# EAGLE schematic PCB(beta) (EAGLE 8.1.0), part 1 of 2

## Sheet 1 of 20: Joule Connectors
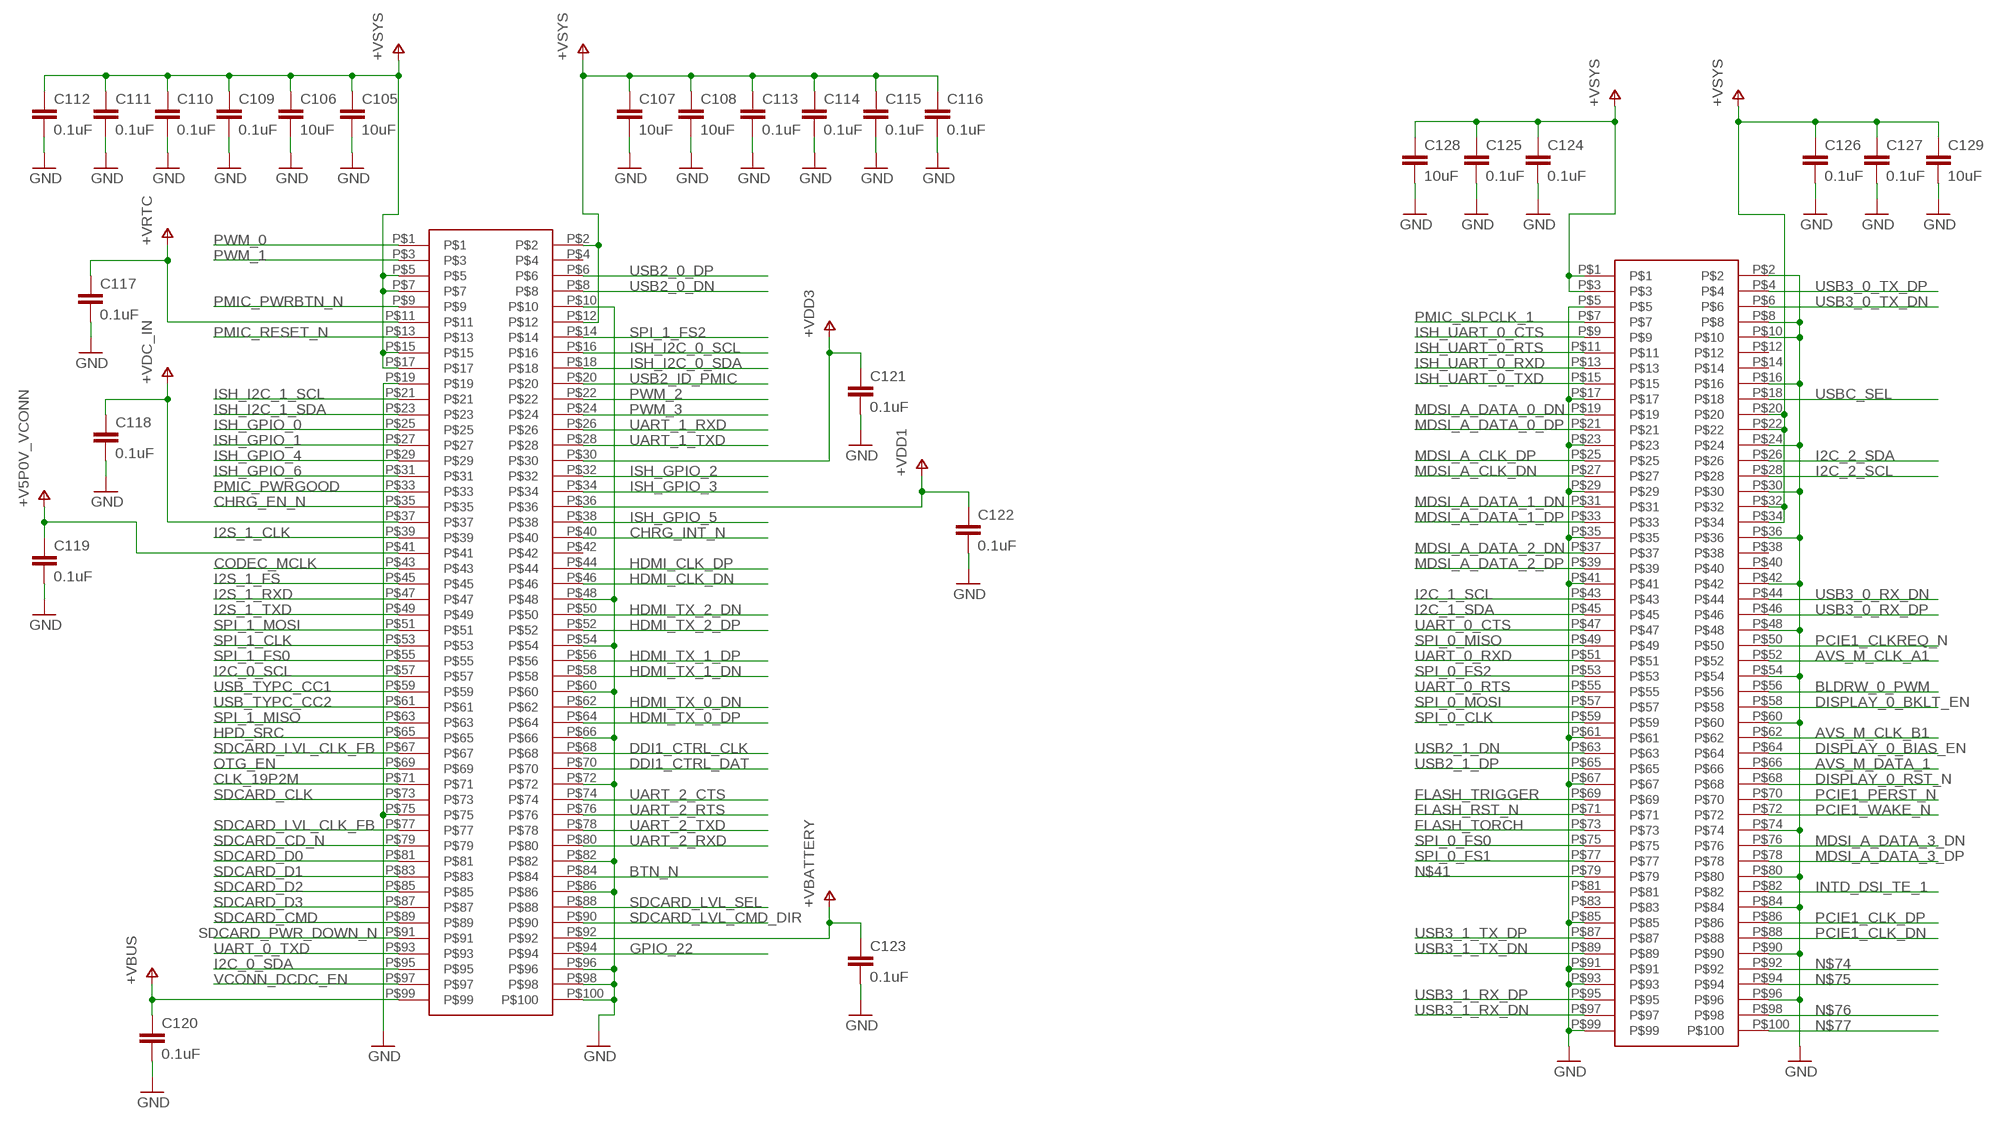
[diagram p0: schematic, sheet 1]

### Parts
C105  10uF  10UF-0603-6.3V-20%  [0603]
C106  10uF  10UF-0603-6.3V-20%  [0603]
C107  10uF  10UF-0603-6.3V-20%  [0603]
C108  10uF  10UF-0603-6.3V-20%  [0603]
C109  0.1uF  0.1UF-0603-25V-(+80/-20%)  [0603]
C110  0.1uF  0.1UF-0603-25V-(+80/-20%)  [0603]
C111  0.1uF  0.1UF-0603-25V-(+80/-20%)  [0603]
C112  0.1uF  0.1UF-0603-25V-(+80/-20%)  [0603]
C113  0.1uF  0.1UF-0603-25V-(+80/-20%)  [0603]
C114  0.1uF  0.1UF-0603-25V-(+80/-20%)  [0603]
C115  0.1uF  0.1UF-0603-25V-(+80/-20%)  [0603]
C116  0.1uF  0.1UF-0603-25V-(+80/-20%)  [0603]
C117  0.1uF  0.1UF-0603-25V-(+80/-20%)  [0603]
C118  0.1uF  0.1UF-0603-25V-(+80/-20%)  [0603]
C119  0.1uF  0.1UF-0603-25V-(+80/-20%)  [0603]
C120  0.1uF  0.1UF-0603-25V-(+80/-20%)  [0603]
C121  0.1uF  0.1UF-0603-25V-(+80/-20%)  [0603]
C122  0.1uF  0.1UF-0603-25V-(+80/-20%)  [0603]
C123  0.1uF  0.1UF-0603-25V-(+80/-20%)  [0603]
C124  0.1uF  0.1UF-0603-25V-(+80/-20%)  [0603]
C125  0.1uF  0.1UF-0603-25V-(+80/-20%)  [0603]
C126  0.1uF  0.1UF-0603-25V-(+80/-20%)  [0603]
C127  0.1uF  0.1UF-0603-25V-(+80/-20%)  [0603]
C128  10uF  10UF-0603-6.3V-20%  [0603]
C129  10uF  10UF-0603-6.3V-20%  [0603]
U$55  DF40C-100DS-0.4V(51)_100PINCONNECTOR  [100-DF40]
U$56  DF40C-100DS-0.4V(51)_100PINCONNECTOR  [100-DF40]

### Nets
+V5P0V_VCONN: C119.1 U$55.P$41
+VBATTERY: C123.1 U$55.P$92 ; also sheet 3
+VBUS: C120.1 U$55.P$99 ; also sheet 2,4,7
+VDC_IN: C118.1 U$55.P$37 ; also sheet 2
+VDD1: C122.1 U$55.P$36 ; also sheet 6,14,16,17
+VDD3: C121.1 U$55.P$30 ; also sheet 4,5,14
+VRTC: C117.1 U$55.P$11 ; also sheet 17
+VSYS: C105.1 C106.1 C107.1 C108.1 C109.1 C110.1 C111.1 C112.1 C113.1 C114.1 C115.1 C116.1 U$55.P$2 U$55.P$5 U$55.P$7 U$55.P$12 U$55.P$15 U$55.P$17 ; also sheet 3,4,5,6
AVS_M_CLK_A1: U$56.P$52 ; also sheet 15
AVS_M_CLK_B1: U$56.P$62 ; also sheet 15
AVS_M_DATA_1: U$56.P$66 ; also sheet 15
BLDRW_0_PWM: U$56.P$56 ; also sheet 15
BTN_N: U$55.P$84 ; also sheet 16
CHRG_EN_N: U$55.P$35 ; also sheet 3
CHRG_INT_N: U$55.P$40 ; also sheet 3
CLK_19P2M: U$55.P$71 ; also sheet 13
CODEC_MCLK: U$55.P$43 ; also sheet 13
DDI1_CTRL_CLK: U$55.P$68 ; also sheet 11
DDI1_CTRL_DAT: U$55.P$70 ; also sheet 11
DISPLAY_0_BIAS_EN: U$56.P$64 ; also sheet 15
DISPLAY_0_BKLT_EN: U$56.P$58 ; also sheet 15
DISPLAY_0_RST_N: U$56.P$68 ; also sheet 15
FLASH_RST_N: U$56.P$71 ; also sheet 15
FLASH_TORCH: U$56.P$73 ; also sheet 15
FLASH_TRIGGER: U$56.P$69 ; also sheet 15
GND: C105.2 C106.2 C107.2 C108.2 C109.2 C110.2 C111.2 C112.2 C113.2 C114.2 C115.2 C116.2 C117.2 C118.2 C119.2 C120.2 C121.2 C122.2 C123.2 C124.2 C125.2 C126.2 C127.2 C128.2 C129.2 U$55.P$10 U$55.P$19 U$55.P$48 U$55.P$54 U$55.P$60 U$55.P$66 U$55.P$72 U$55.P$75 U$55.P$82 U$55.P$86 U$55.P$96 U$55.P$98 U$55.P$100 U$56.P$2 U$56.P$5 U$56.P$8 U$56.P$10 U$56.P$16 U$56.P$17 U$56.P$23 U$56.P$24 U$56.P$29 U$56.P$30 U$56.P$35 U$56.P$36 U$56.P$41 U$56.P$42 U$56.P$48 U$56.P$54 U$56.P$60 U$56.P$61 U$56.P$67 U$56.P$74 U$56.P$80 U$56.P$84 U$56.P$85 U$56.P$90 U$56.P$91 U$56.P$93 U$56.P$96 U$56.P$99 ; also sheet 2,3,4,5,6,7,9,10,11,12,13,14,15,16,17,18,19,20
GPIO_22: U$55.P$94 ; also sheet 13
HDMI_CLK_DN: U$55.P$46 ; also sheet 11
HDMI_CLK_DP: U$55.P$44 ; also sheet 11
HDMI_TX_0_DN: U$55.P$62 ; also sheet 11
HDMI_TX_0_DP: U$55.P$64 ; also sheet 11
HDMI_TX_1_DN: U$55.P$58 ; also sheet 11
HDMI_TX_1_DP: U$55.P$56 ; also sheet 11
HDMI_TX_2_DN: U$55.P$50 ; also sheet 11
HDMI_TX_2_DP: U$55.P$52 ; also sheet 11
HPD_SRC: U$55.P$65 ; also sheet 11
I2C_0_SCL: U$55.P$57 ; also sheet 3,13,17
I2C_0_SDA: U$55.P$95 ; also sheet 3,13,17
I2C_1_SCL: U$56.P$43 ; also sheet 15
I2C_1_SDA: U$56.P$45 ; also sheet 15
I2C_2_SCL: U$56.P$28 ; also sheet 15
I2C_2_SDA: U$56.P$26 ; also sheet 15
I2S_1_CLK: U$55.P$39 ; also sheet 13
I2S_1_FS: U$55.P$45 ; also sheet 13
I2S_1_RXD: U$55.P$47 ; also sheet 13
I2S_1_TXD: U$55.P$49 ; also sheet 13
INTD_DSI_TE_1: U$56.P$82
ISH_GPIO_0: U$55.P$25 ; also sheet 13,14
ISH_GPIO_1: U$55.P$27 ; also sheet 13,14
ISH_GPIO_2: U$55.P$32 ; also sheet 13,14
ISH_GPIO_3: U$55.P$34 ; also sheet 13,14
ISH_GPIO_4: U$55.P$29 ; also sheet 13
ISH_GPIO_5: U$55.P$38 ; also sheet 13
ISH_GPIO_6: U$55.P$31 ; also sheet 13
ISH_I2C_0_SCL: U$55.P$16 ; also sheet 13
ISH_I2C_0_SDA: U$55.P$18 ; also sheet 13
ISH_I2C_1_SCL: U$55.P$21 ; also sheet 13
ISH_I2C_1_SDA: U$55.P$23 ; also sheet 13
ISH_UART_0_CTS: U$56.P$9 ; also sheet 15
ISH_UART_0_RTS: U$56.P$11 ; also sheet 15
ISH_UART_0_RXD: U$56.P$13 ; also sheet 15
ISH_UART_0_TXD: U$56.P$15 ; also sheet 15
MDSI_A_CLK_DN: U$56.P$27
MDSI_A_CLK_DP: U$56.P$25
MDSI_A_DATA_0_DN: U$56.P$19
MDSI_A_DATA_0_DP: U$56.P$21
MDSI_A_DATA_1_DN: U$56.P$31
MDSI_A_DATA_1_DP: U$56.P$33
MDSI_A_DATA_2_DN: U$56.P$37
MDSI_A_DATA_2_DP: U$56.P$39
MDSI_A_DATA_3_DN: U$56.P$76
MDSI_A_DATA_3_DP: U$56.P$78
N$41: U$56.P$79
N$74: U$56.P$92
N$75: U$56.P$94
N$76: U$56.P$98
N$77: U$56.P$100
OTG_EN: U$55.P$69 ; also sheet 4
PCIE1_CLK_DN: U$56.P$88
PCIE1_CLK_DP: U$56.P$86
PCIE1_CLKREQ_N: U$56.P$50
PCIE1_PERST_N: U$56.P$70
PCIE1_WAKE_N: U$56.P$72
PMIC_PWRBTN_N: U$55.P$9 ; also sheet 3,16
PMIC_PWRGOOD: U$55.P$33 ; also sheet 13
PMIC_RESET_N: U$55.P$13 ; also sheet 13
PMIC_SLPCLK_1: U$56.P$7 ; also sheet 15
PWM_0: U$55.P$1 ; also sheet 13
PWM_1: U$55.P$3 ; also sheet 13
PWM_2: U$55.P$22 ; also sheet 13
PWM_3: U$55.P$24 ; also sheet 13
SDCARD_CD_N: U$55.P$79 ; also sheet 10
SDCARD_CLK: U$55.P$73 ; also sheet 10
SDCARD_CMD: U$55.P$89 ; also sheet 10
SDCARD_D0: U$55.P$81 ; also sheet 10
SDCARD_D1: U$55.P$83 ; also sheet 10
SDCARD_D2: U$55.P$85 ; also sheet 10
SDCARD_D3: U$55.P$87 ; also sheet 10
SDCARD_LVL_CLK_FB: U$55.P$67 U$55.P$77 ; also sheet 10
SDCARD_LVL_CMD_DIR: U$55.P$90 ; also sheet 10
SDCARD_LVL_SEL: U$55.P$88 ; also sheet 10
SDCARD_PWR_DOWN_N: U$55.P$91 ; also sheet 10
SPI_0_CLK: U$56.P$59 ; also sheet 15
SPI_0_FS0: U$56.P$75 ; also sheet 15
SPI_0_FS1: U$56.P$77 ; also sheet 15
SPI_0_FS2: U$56.P$53 ; also sheet 15
SPI_0_MISO: U$56.P$49 ; also sheet 15
SPI_0_MOSI: U$56.P$57 ; also sheet 15
SPI_1_CLK: U$55.P$53 ; also sheet 13
SPI_1_FS0: U$55.P$55 ; also sheet 13
SPI_1_FS2: U$55.P$14 ; also sheet 13,16
SPI_1_MISO: U$55.P$63 ; also sheet 13
SPI_1_MOSI: U$55.P$51 ; also sheet 13
UART_0_CTS: U$56.P$47 ; also sheet 15
UART_0_RTS: U$56.P$55 ; also sheet 15
UART_0_RXD: U$56.P$51 ; also sheet 15
UART_0_TXD: U$55.P$93 ; also sheet 13
UART_1_RXD: U$55.P$26 ; also sheet 13
UART_1_TXD: U$55.P$28 ; also sheet 13,16
UART_2_CTS: U$55.P$74 ; also sheet 9
UART_2_RTS: U$55.P$76 ; also sheet 9
UART_2_RXD: U$55.P$80 ; also sheet 9
UART_2_TXD: U$55.P$78 ; also sheet 9,16
USB2_0_DN: U$55.P$8 ; also sheet 7
USB2_0_DP: U$55.P$6 ; also sheet 7
USB2_1_DN: U$56.P$63 ; also sheet 8
USB2_1_DP: U$56.P$65 ; also sheet 8
USB2_ID_PMIC: U$55.P$20
USB3_0_RX_DN: U$56.P$44 ; also sheet 7
USB3_0_RX_DP: U$56.P$46 ; also sheet 7
USB3_0_TX_DN: U$56.P$6 ; also sheet 7
USB3_0_TX_DP: U$56.P$4 ; also sheet 7
USB3_1_RX_DN: U$56.P$97 ; also sheet 8
USB3_1_RX_DP: U$56.P$95 ; also sheet 8
USB3_1_TX_DN: U$56.P$89 ; also sheet 8
USB3_1_TX_DP: U$56.P$87 ; also sheet 8
USB_TYPC_CC1: U$55.P$59 ; also sheet 7
USB_TYPC_CC2: U$55.P$61 ; also sheet 7
USBC_SEL: U$56.P$18 ; also sheet 7
V+: C124.1 C125.1 C126.1 C127.1 C128.1 C129.1 U$56.P$1 U$56.P$3 U$56.P$20 U$56.P$22 U$56.P$32 U$56.P$34 ; supply symbol labelled +VSYS ; also sheet 3
VCONN_DCDC_EN: U$55.P$97 ; also sheet 4
Unconnected: U$55.P$4 U$55.P$42 U$56.P$12 U$56.P$14 U$56.P$38 U$56.P$40 U$56.P$81 U$56.P$83

## Sheet 2 of 20: Input Power Distribution
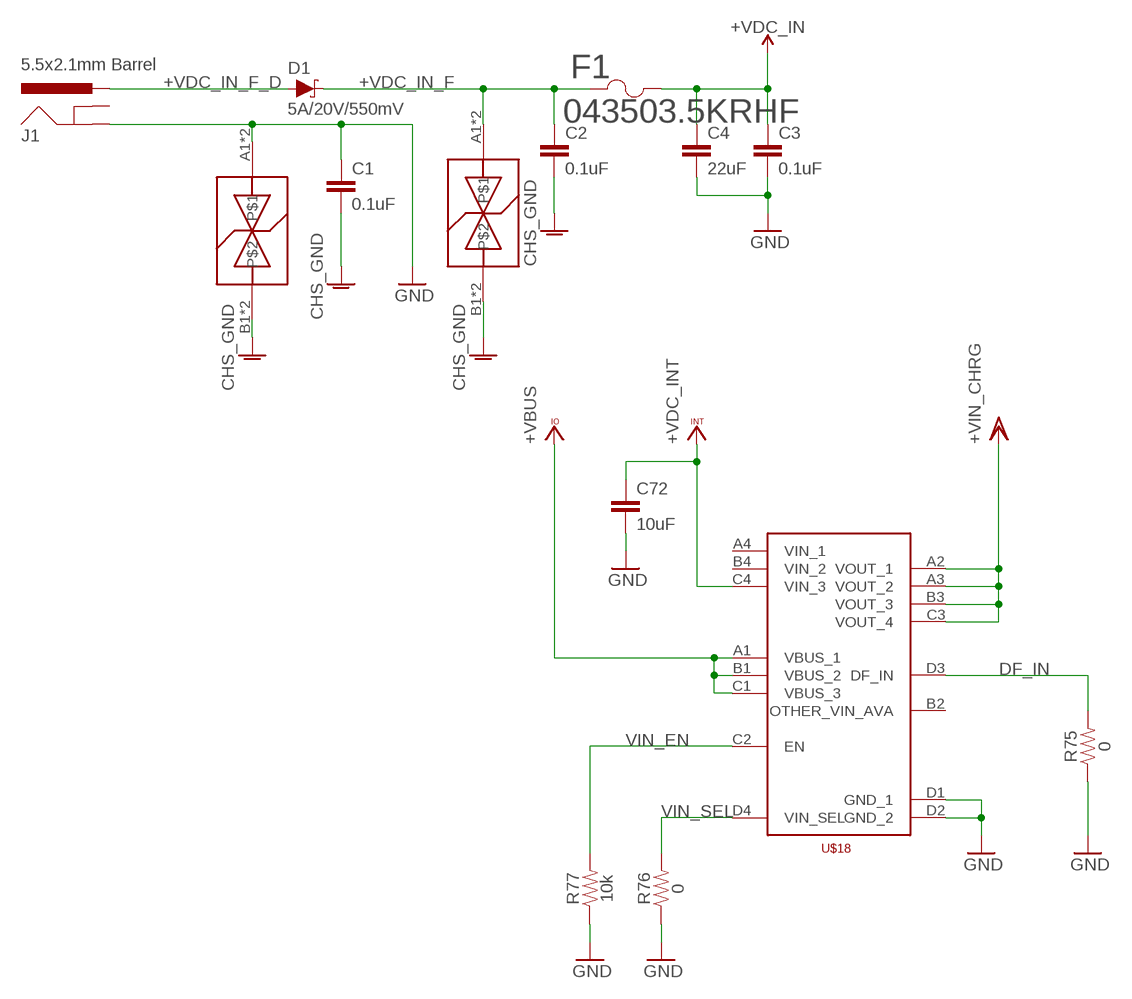
[diagram p1: schematic, sheet 2]

### Parts
C1  0.1uF  0.1UF-0603-25V-(+80/-20%)  [0603]
C2  0.1uF  0.1UF-0603-25V-(+80/-20%)  [0603]
C3  0.1uF  0.1UF-0603-25V-(+80/-20%)  [0603]
C4  22uF  22UF-0805-6.3V-20%  [0805]
C72  10uF  10UF-0603-6.3V-20%  [0603]
D1  5A/20V/550mV  DIODE-SCHOTTKY-B340A  [SMA-DIODE]
F1  043503.5KRHF  [0435SERIES]
J1  5.5x2.1mm Barrel  POWER_JACKSMD  [POWER_JACK_SMD]
R75  0  0OHM-0603-1/10W-5%  [0603]
R76  0  0OHM-0603-1/10W-5%  [0603]
R77  10k  10KOHM-0603-1/10W-1%  [0603]
U$2  LFTVS18-1F3_FLIPCHIP  [4-UFBGA]
U$3  LFTVS18-1F3_FLIPCHIP  [4-UFBGA]
U$18  FPF3042UCX  [16-WLCSP]

### Nets
+VBUS: U$18.A1(VBUS_1) U$18.B1(VBUS_2) U$18.C1(VBUS_3) ; also sheet 1,4,7
+VDC_IN: C3.1 C4.1 C72.1 F1.2 U$18.C4(VIN_3) ; supply symbol labelled +VDC_INT ; also sheet 1
+VDC_IN_F: C2.1 D1.C F1.1 U$2.A1 U$2.A2
+VDC_IN_F_D: D1.A J1.VIN0(PWR)
+VIN_CHRG: U$18.A2(VOUT_1) U$18.A3(VOUT_2) U$18.B3(VOUT_3) U$18.C3(VOUT_4) ; also sheet 3
CHS_GND: C1.2 C2.2 U$2.B1 U$2.B2 U$3.B1 U$3.B2 ; also sheet 7,8,9,10,12,17
DF_IN: R75.2 U$18.D3(DF_IN)
GND: C1.1 C3.2 C4.2 C72.2 J1.P$4(GND) R75.1 R76.1 R77.1 U$3.A1 U$3.A2 U$18.D1(GND_1) U$18.D2(GND_2) ; also sheet 1,3,4,5,6,7,9,10,11,12,13,14,15,16,17,18,19,20
VIN_EN: R77.2 U$18.C2(EN)
VIN_SEL: R76.2 U$18.D4(VIN_SEL)
Unconnected: J1.GND(GNDBREAK) U$18.A4(VIN_1) U$18.B2(OTHER_VIN_AVA) U$18.B4(VIN_2)

## Sheet 3 of 20: Battery Regulatpr
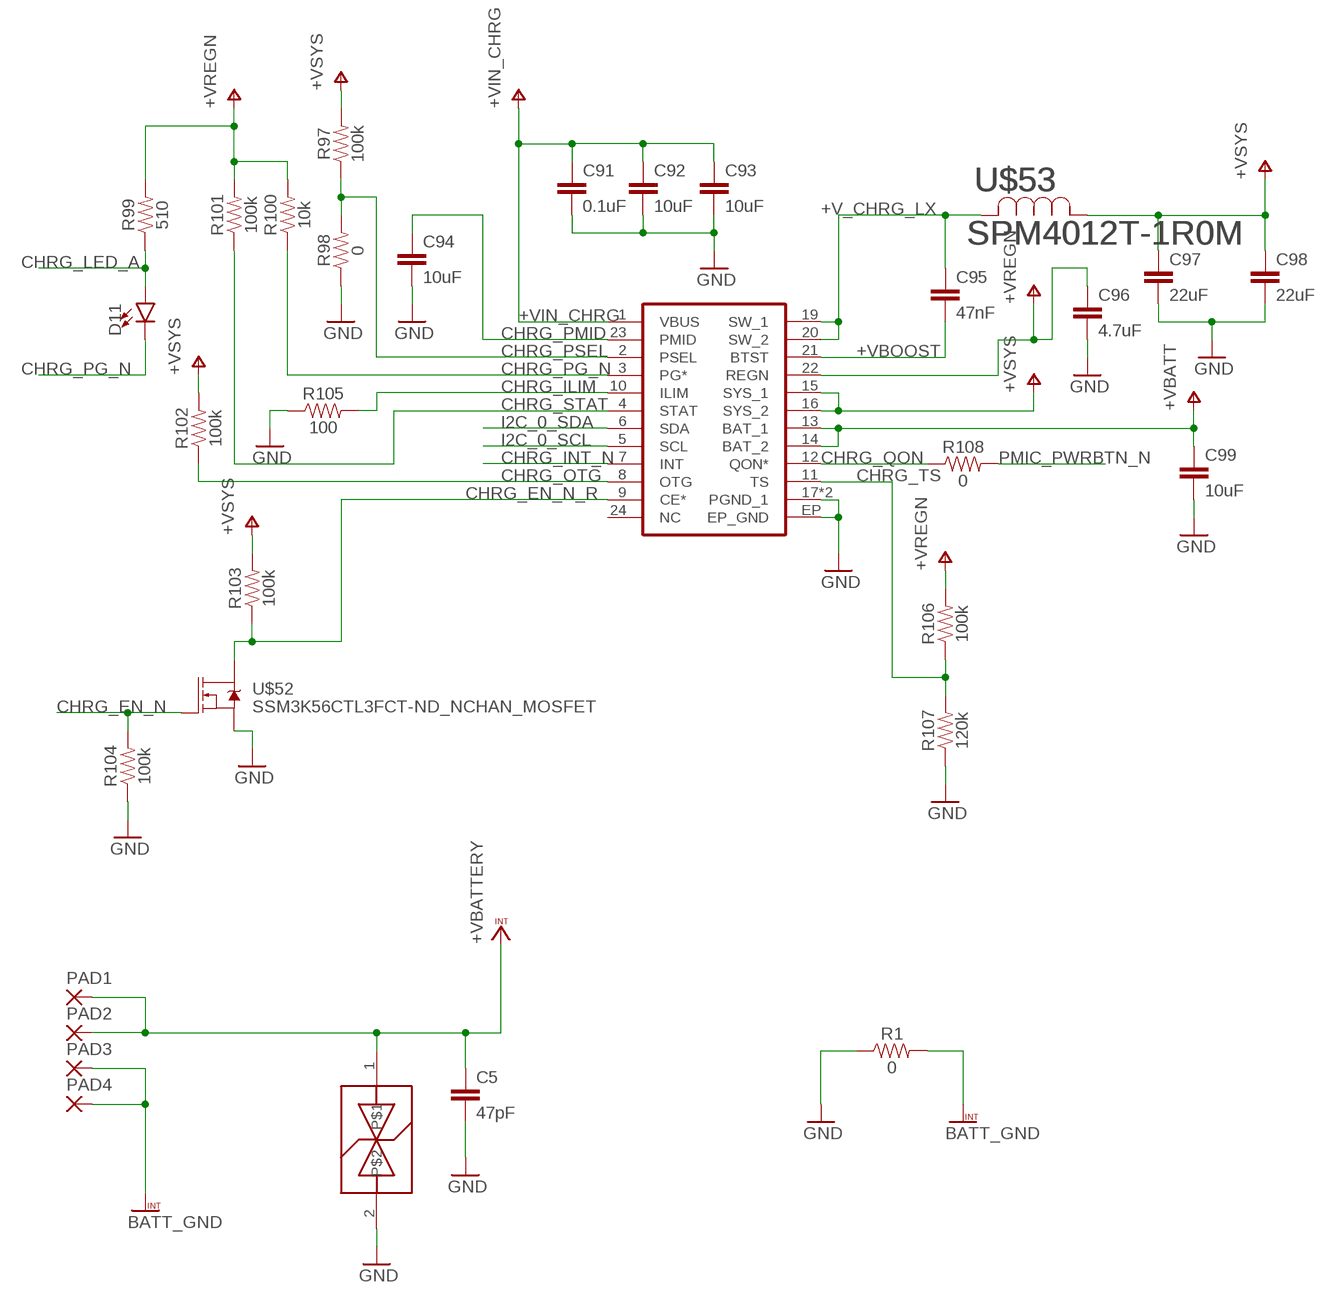
[diagram p2: schematic, sheet 3]

### Parts
C5  47pF  47PF-0603-50V-5%  [0603]
C91  0.1uF  0.1UF-0603-25V-(+80/-20%)  [0603]
C92  10uF  10UF-0603-6.3V-20%  [0603]
C93  10uF  10UF-0603-6.3V-20%  [0603]
C94  10uF  10UF-0603-6.3V-20%  [0603]
C95  47nF  47NF-0603-25V-5%  [0603]
C96  4.7uF  4.7UF0603  [0603]
C97  22uF  22UF-0805-6.3V-20%  [0805]
C98  22uF  22UF-0805-6.3V-20%  [0805]
C99  10uF  10UF-0603-6.3V-20%  [0603]
D11  LED0603  [LED-0603]
PAD1  2,54/1,0  [2,54/1,0]
PAD2  2,54/1,0  [2,54/1,0]
PAD3  2,54/1,0  [2,54/1,0]
PAD4  2,54/1,0  [2,54/1,0]
R1  0  0OHM-0603-1/10W-5%  [0603]
R97  100k  100KOHM-0603-1/10W-1%  [0603]
R98  0  0OHM-0603-1/10W-5%  [0603]
R99  510  510OHM-2010-1/2W-5%  [2010]
R100  10k  10KOHM-0603-1/10W-1%  [0603]
R101  100k  100KOHM-0603-1/10W-1%  [0603]
R102  100k  100KOHM-0603-1/10W-1%  [0603]
R103  100k  100KOHM-0603-1/10W-1%  [0603]
R104  100k  100KOHM-0603-1/10W-1%  [0603]
R105  100  100OHM-0603-1/4W-5%  [0603]
R106  100k  100KOHM-0603-1/10W-1%  [0603]
R107  120k  100KOHM-0603-1/10W-1%  [0603]
R108  0  0OHM-0603-1/10W-5%  [0603]
U$50  LXES15AAA1-100_ESD_SUPPRESSOR  [0402]
U$51  BQ25892RTWT  [WQFN-24]
U$52  SSM3K56CTL3FCT-ND_NCHAN_MOSFET  [3-XFDFN]
U$53  SPM4012T-1R0M  [IND_SPM4020]

### Nets
+V_CHRG_LX: C95.1 U$51.19(SW_1) U$51.20(SW_2) U$53.2
+VBATTERY: C5.1 PAD1.1(P) PAD2.1(P) U$50.1 ; also sheet 1
+VBOOST: C95.2 U$51.21(BTST)
+VIN_CHRG: C91.1 C92.1 C93.1 U$51.1(VBUS) ; also sheet 2
+VREGN: C96.1 R99.2 R100.2 R101.2 R106.2 U$51.22(REGN)
+VSYS: C97.1 C98.1 R97.2 R102.2 R103.2 U$51.15(SYS_1) U$51.16(SYS_2) U$53.1 ; also sheet 1,4,5,6
BATT_GND: PAD3.1(P) PAD4.1(P) R1.2
CHRG_EN_N: R104.2 U$52.P$1(G) ; also sheet 1
CHRG_EN_N_R: R103.1 U$51.9(CE*) U$52.P$3(D)
CHRG_ILIM: R105.2 U$51.10(ILIM)
CHRG_INT_N: U$51.7(INT) ; also sheet 1
CHRG_LED_A: D11.A R99.1
CHRG_OTG: R102.1 U$51.8(OTG)
CHRG_PG_N: D11.C R100.1 U$51.3(PG*)
CHRG_PMID: C94.1 U$51.23(PMID)
CHRG_PSEL: R97.1 R98.2 U$51.2(PSEL)
CHRG_QON: R108.1 U$51.12(QON*)
CHRG_STAT: R101.1 U$51.4(STAT)
CHRG_TS: R106.1 R107.2 U$51.11(TS)
GND: C5.2 C91.2 C92.2 C93.2 C94.2 C96.2 C97.2 C98.2 C99.2 R1.1 R98.1 R104.1 R105.1 R107.1 U$50.2 U$51.17(PGND_1) U$51.18(PGND_1) U$51.EP(EP_GND) U$52.P$2(S) ; also sheet 1,2,4,5,6,7,9,10,11,12,13,14,15,16,17,18,19,20
I2C_0_SCL: U$51.5(SCL) ; also sheet 1,13,17
I2C_0_SDA: U$51.6(SDA) ; also sheet 1,13,17
PMIC_PWRBTN_N: R108.2 ; also sheet 1,16
V+: C99.1 U$51.13(BAT_1) U$51.14(BAT_2) ; supply symbol labelled +VBATT ; also sheet 1
Unconnected: U$51.24(NC)

## Sheet 4 of 20: Power Regulation
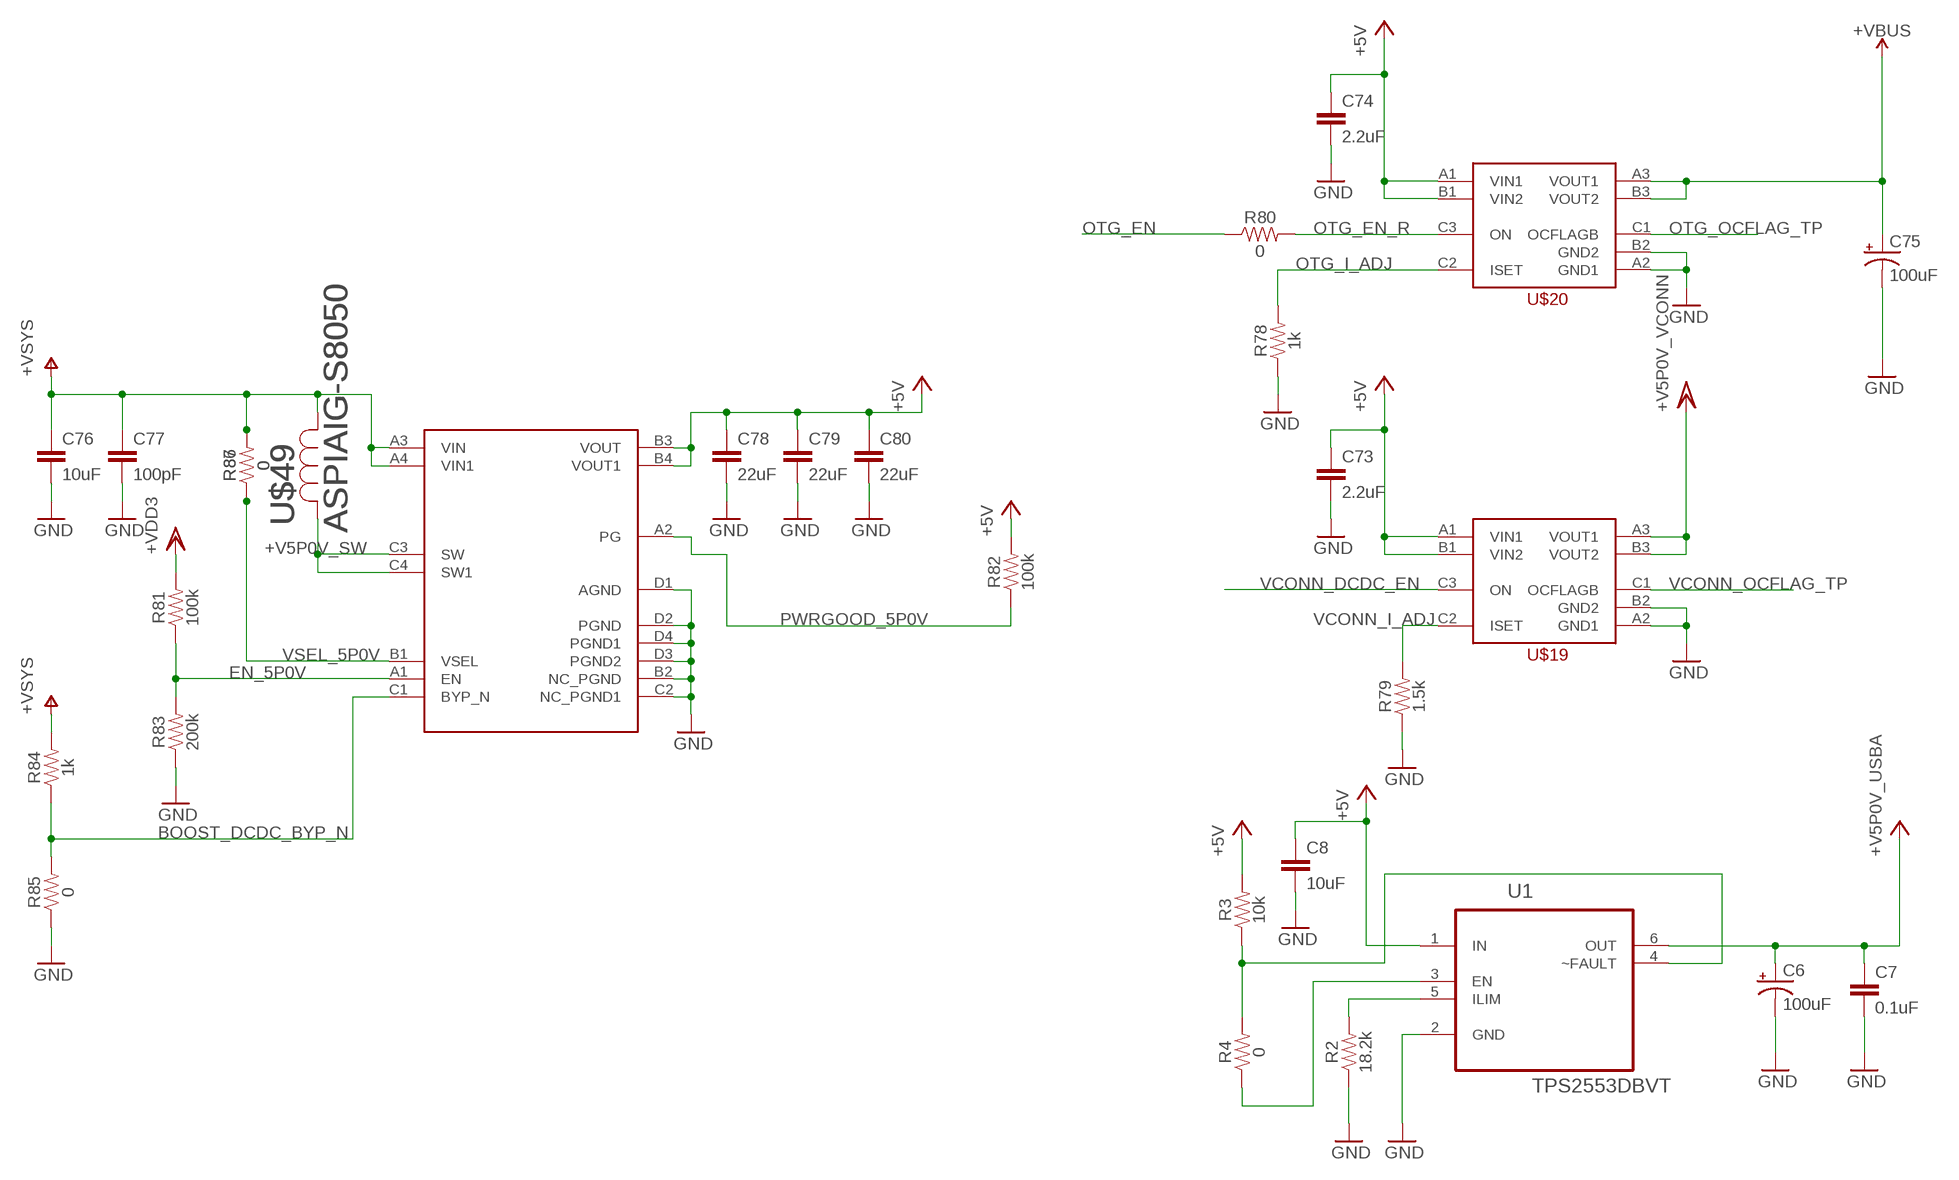
[diagram p3: schematic, sheet 4]

### Parts
C6  100uF  100UF-POLAR-EIA7343-10V-10%(TANT)  [EIA7343]
C7  0.1uF  0.1UF-0603-25V-(+80/-20%)  [0603]
C8  10uF  10UF-0603-6.3V-20%  [0603]
C73  2.2uF  2.2UF-0603-10V-20%  [0603]
C74  2.2uF  2.2UF-0603-10V-20%  [0603]
C75  100uF  100UF-POLAR-10X10.5-63V-20%  [NIC_10X10.5_CAP]
C76  10uF  10UF-0603-6.3V-20%  [0603]
C77  100pF  100PF-0603-50V-5%  [0603]
C78  22uF  22UF-0805-6.3V-20%  [0805]
C79  22uF  22UF-0805-6.3V-20%  [0805]
C80  22uF  22UF-0805-6.3V-20%  [0805]
R2  18.2k  1.8KOHM-0603-1/10W-1%  [0603]
R3  10k  10KOHM-0603-1/10W-1%  [0603]
R4  0  0OHM-0603-1/10W-5%  [0603]
R78  1k  1KOHM-0603-1/10W-1%  [0603]
R79  1.5k  1.5KOHM-0603-1/10W-1%  [0603]
R80  0  0OHM-0603-1/10W-5%  [0603]
R81  100k  100KOHM-0603-1/10W-1%  [0603]
R82  100k  100KOHM-0603-1/10W-1%  [0603]
R83  200k  200KOHM-0603-1/10W-1%  [0603]
R84  1k  1KOHM-0603-1/10W-1%  [0603]
R85  0  0OHM-0603-1/10W-5%  [0603]
R86  0  0OHM-0603-1/10W-5%  [0603]
R87  0  0OHM-0603-1/10W-5%  [0603]
U1  TPS2553DBVT  [SOT95P280X145-6N]
U$19  FPF2495UCX  [9-WLCSP]
U$20  FPF2495UCX  [9-WLCSP]
U$21  FAN48623UC50X_SWITCHING_REGULATOR  [16-WLCSP]
U$49  ASPIAIG-S8050  [ASPIAIG-S8050]

### Nets
+5V: C8.1 C73.1 C74.1 C78.1 C79.1 C80.1 R3.2 R82.2 U1.1(IN) U$19.A1(VIN1) U$19.B1(VIN2) U$20.A1(VIN1) U$20.B1(VIN2) U$21.B3(VOUT) U$21.B4(VOUT1) ; also sheet 9,12,14,15,17,18,19
+V5P0V_CONN: U$19.A3(VOUT1) U$19.B3(VOUT2) ; supply symbol labelled +V5P0V_VCONN
+V5P0V_SW: U$21.C3(SW) U$21.C4(SW1) U$49.2
+V5P0V_USBA: C6.A(+) C7.1 U1.6(OUT)
+VBUS: C75.+ U$20.A3(VOUT1) U$20.B3(VOUT2) ; also sheet 1,2,7
+VDD3: R81.2 ; also sheet 1,5,14
+VSYS: C76.1 C77.1 R84.2 R86.2 R87.2 U$21.A3(VIN) U$21.A4(VIN1) U$49.1 ; also sheet 1,3,5,6
BOOST_DCDC_BYP_N: R84.1 R85.2 U$21.C1(BYP_N)
EN_5P0V: R81.1 R83.2 U$21.A1(EN)
GND: C6.C(-) C7.2 C8.2 C73.2 C74.2 C75.- C76.2 C77.2 C78.2 C79.2 C80.2 R2.1 R78.1 R79.1 R83.1 R85.1 U1.2(GND) U$19.A2(GND1) U$19.B2(GND2) U$20.A2(GND1) U$20.B2(GND2) U$21.B2(NC_PGND) U$21.C2(NC_PGND1) U$21.D1(AGND) U$21.D2(PGND) U$21.D3(PGND2) U$21.D4(PGND1) ; also sheet 1,2,3,5,6,7,9,10,11,12,13,14,15,16,17,18,19,20
N$5: R2.2 U1.5(ILIM)
OTG_EN: R80.1 ; also sheet 1
OTG_EN_R: R80.2 U$20.C3(ON)
OTG_I_ADJ: R78.2 U$20.C2(ISET)
OTG_OCFLAG_TP: U$20.C1(OCFLAGB)
PWRGOOD_5P0V: R82.1 U$21.A2(PG)
USB3_CONN_EN: R4.1 U1.3(EN)
USB3_CONN_FLT: R3.1 R4.2 U1.4(~FAULT)
VCONN_DCDC_EN: U$19.C3(ON) ; also sheet 1
VCONN_I_ADJ: R79.2 U$19.C2(ISET)
VCONN_OCFLAG_TP: U$19.C1(OCFLAGB)
VSEL_5P0V: R86.1 R87.1 U$21.B1(VSEL)

## Sheet 5 of 20: +3.3V Reguator
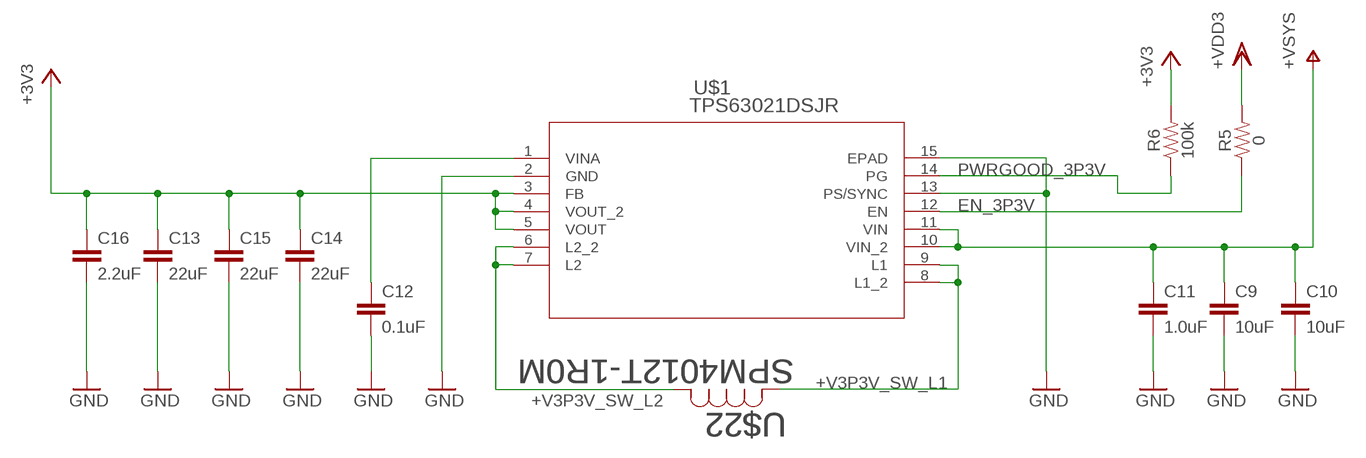
[diagram p4: schematic, sheet 5]

### Parts
C9  10uF  10UF-0603-6.3V-20%  [0603]
C10  10uF  10UF-0603-6.3V-20%  [0603]
C11  1.0uF  1.0UF-0603-16V-10%  [0603]
C12  0.1uF  0.1UF-0603-25V-(+80/-20%)  [0603]
C13  22uF  22UF-0805-6.3V-20%  [0805]
C14  22uF  22UF-0805-6.3V-20%  [0805]
C15  22uF  22UF-0805-6.3V-20%  [0805]
C16  2.2uF  2.2UF-0603-10V-20%  [0603]
R5  0  0OHM-0603-1/10W-5%  [0603]
R6  100k  100KOHM-0603-1/10W-1%  [0603]
U$1  TPS63021DSJR  [DSJ14_2P85X1P58]
U$22  SPM4012T-1R0M  [IND_SPM4020]

### Nets
+3V3: C13.1 C14.1 C15.1 C16.1 R6.2 U$1.3(FB) U$1.4(VOUT_2) U$1.5(VOUT) ; also sheet 7,9,10,11,13,15,17,18,19,20
+V3P3V_SW_L1: U$1.8(L1_2) U$1.9(L1) U$22.2
+V3P3V_SW_L2: U$1.6(L2_2) U$1.7(L2) U$22.1
+V3P3V_VINA: C12.1 U$1.1(VINA)
+VDD3: R5.2 ; also sheet 1,4,14
+VSYS: C9.1 C10.1 C11.1 U$1.10(VIN_2) U$1.11(VIN) ; also sheet 1,3,4,6
EN_3P3V: R5.1 U$1.12(EN)
GND: C9.2 C10.2 C11.2 C12.2 C13.2 C14.2 C15.2 C16.2 U$1.2(GND) U$1.13(PS/SYNC) U$1.15(EPAD) ; also sheet 1,2,3,4,6,7,9,10,11,12,13,14,15,16,17,18,19,20
PWRGOOD_3P3V: R6.1 U$1.14(PG)

## Sheet 6 of 20: +1.8V Regulator
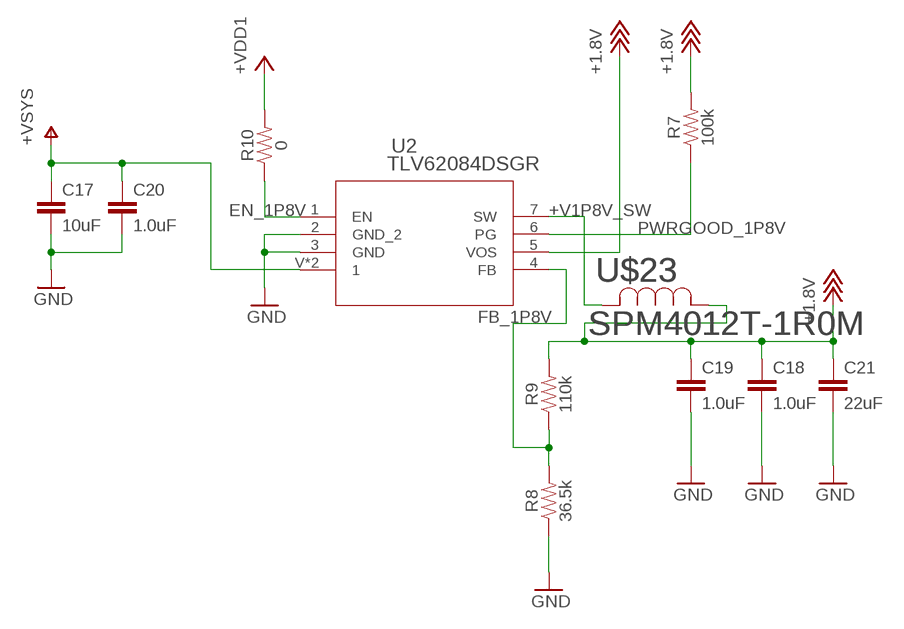
[diagram p5: schematic, sheet 6]

### Parts
C17  10uF  10UF-0603-6.3V-20%  [0603]
C18  1.0uF  1.0UF-0603-16V-10%  [0603]
C19  1.0uF  1.0UF-0603-16V-10%  [0603]
C20  1.0uF  1.0UF-0603-16V-10%  [0603]
C21  22uF  22UF-0805-6.3V-20%  [0805]
R7  100k  100KOHM-0603-1/10W-1%  [0603]
R8  36.5k  2.2OHM-0603-1/10W-5%  [0603]
R9  110k  100KOHM-0603-1/10W-1%  [0603]
R10  0  0OHM-0603-1/10W-5%  [0603]
U2  TLV62084DSGR  [DSG8_0P9X1P6]
U$23  SPM4012T-1R0M  [IND_SPM4020]

### Nets
+1.8V: C18.1 C19.1 C21.1 R7.2 R9.2 U2.5(VOS) U$23.1 ; also sheet 9,10,11,13,15
+V1P8V_SW: U2.7(SW) U$23.2
+VDD1: R10.2 ; also sheet 1,14,16,17
+VSYS: C17.1 C20.1 U2.V U2.V_1 ; also sheet 1,3,4,5
EN_1P8V: R10.1 U2.1(EN)
FB_1P8V: R8.2 R9.1 U2.4(FB)
GND: C17.2 C18.2 C19.2 C20.2 C21.2 R8.1 U2.2(GND_2) U2.3(GND) ; also sheet 1,2,3,4,5,7,9,10,11,12,13,14,15,16,17,18,19,20
PWRGOOD_1P8V: R7.1 U2.6(PG)

## Sheet 7 of 20: USB TYPE C
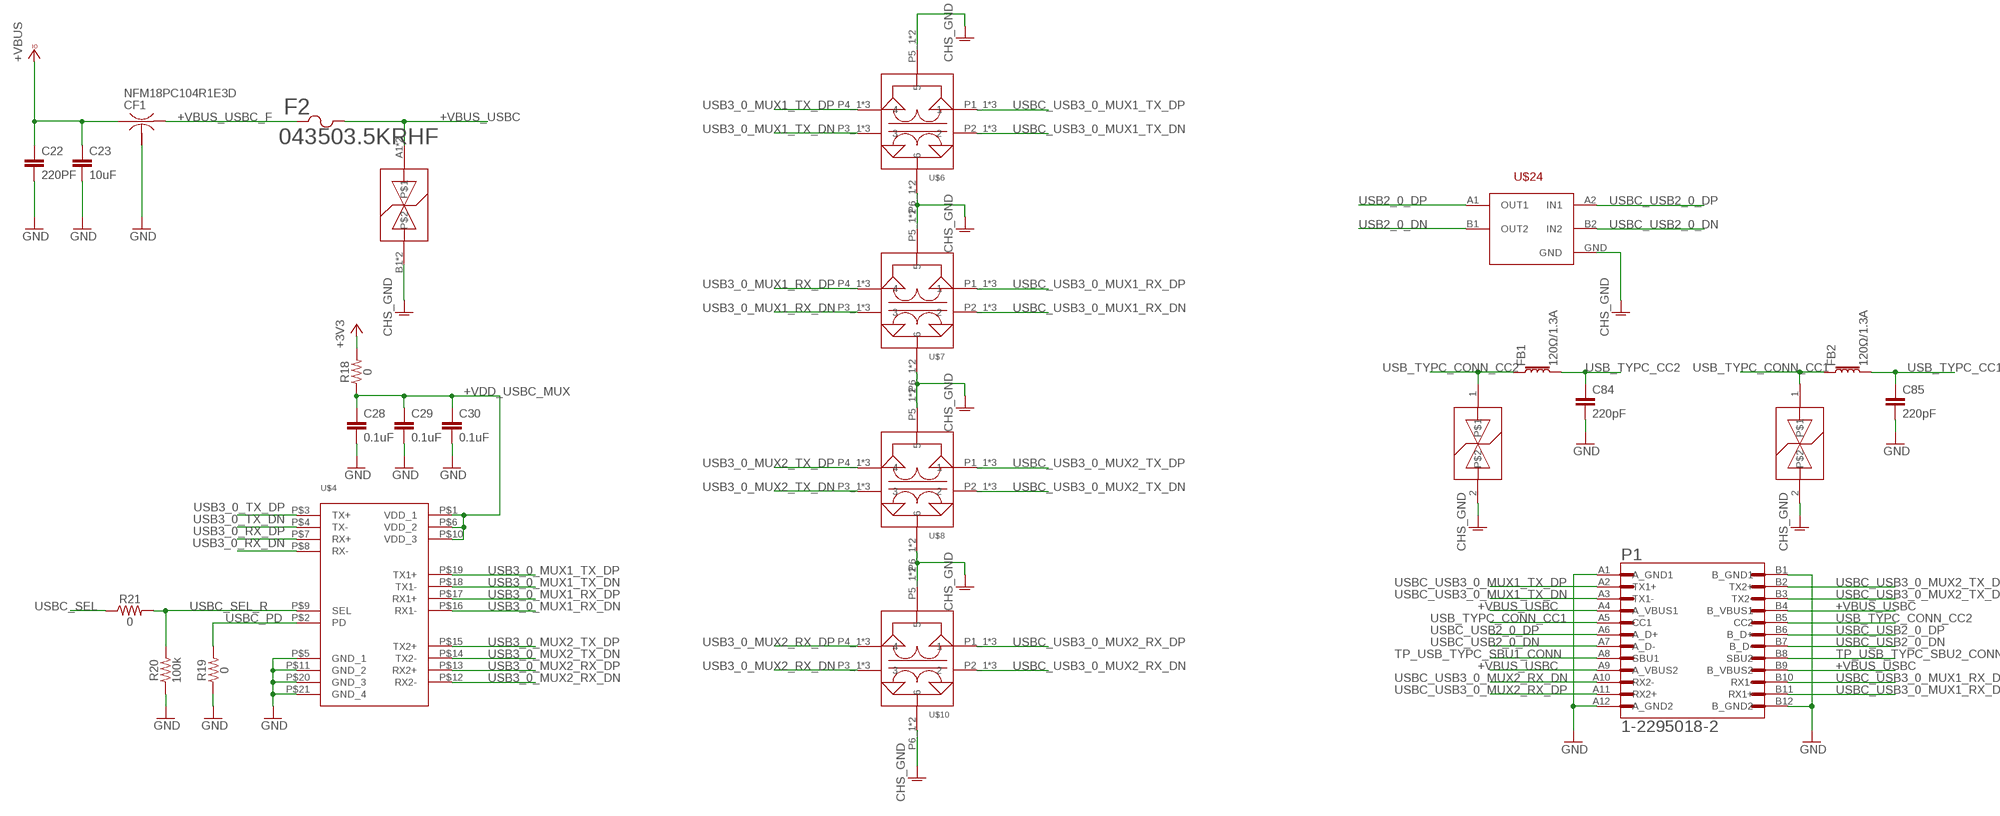
[diagram p6: schematic, sheet 7]

### Parts
C22  220PF  270PF-0603-50V-5%  [0603]
C23  10uF  10UF-0603-6.3V-20%  [0603]
C28  0.1uF  0.1UF-0603-25V-(+80/-20%)  [0603]
C29  0.1uF  0.1UF-0603-25V-(+80/-20%)  [0603]
C30  0.1uF  0.1UF-0603-25V-(+80/-20%)  [0603]
C84  220pF  180PF-0603-50V-5%  [0603]
C85  220pF  180PF-0603-50V-5%  [0603]
CF1  NFM18PC104R1E3D  NFM21C  [NFM21C]
F2  043503.5KRHF  [0435SERIES]
FB1  120Ω/1.3A  FERRITE_BEAD-0603  [0603]
FB2  120Ω/1.3A  FERRITE_BEAD-0603  [0603]
P1  1-2295018-2  [TE_1-2295018-2]
R18  0  0OHM-0603-1/10W-5%  [0603]
R19  0  0OHM-0603-1/10W-5%  [0603]
R20  100k  100KOHM-0603-1/10W-1%  [0603]
R21  0  0OHM-0603-1/10W-5%  [0603]
U$4  PI3USB302-AZBEX_ANALOG_SWITCH  [20-TQFP]
U$5  LFTVS18-1F3_FLIPCHIP  [4-UFBGA]
U$6  TCE0806S-350-2P-T200  [0302_(0806_METRIC)]
U$7  TCE0806S-350-2P-T200  [0302_(0806_METRIC)]
U$8  TCE0806S-350-2P-T200  [0302_(0806_METRIC)]
U$10  TCE0806S-350-2P-T200  [0302_(0806_METRIC)]
U$24  ECMF02-2BF3  [5-WLCSP]
U$31  LXES15AAA1-100_ESD_SUPPRESSOR  [0402]
U$32  LXES15AAA1-100_ESD_SUPPRESSOR  [0402]

### Nets
+3V3: R18.2 ; also sheet 5,9,10,11,13,15,17,18,19,20
+VBUS: C22.1 C23.1 CF1.1 ; also sheet 1,2,4
+VBUS_USBC: F2.2 P1.A4(A_VBUS1) P1.A9(A_VBUS2) P1.B4(B_VBUS1) P1.B9(B_VBUS2) U$5.A1 U$5.A2
+VBUS_USBC_F: CF1.3 F2.1
+VDD_USBC_MUX: C28.1 C29.1 C30.1 R18.1 U$4.P$1(VDD_1) U$4.P$6(VDD_2) U$4.P$10(VDD_3)
CHS_GND: U$5.B1 U$5.B2 U$6.P5_1 U$6.P5_2 U$6.P6_1 U$6.P6_2 U$7.P5_1 U$7.P5_2 U$7.P6_1 U$7.P6_2 U$8.P5_1 U$8.P5_2 U$8.P6_1 U$8.P6_2 U$10.P5_1 U$10.P5_2 U$10.P6_1 U$10.P6_2 U$24.GND U$31.2 U$32.2 ; also sheet 2,8,9,10,12,17
GND: C22.2 C23.2 C28.2 C29.2 C30.2 C84.2 C85.2 CF1.2@1 P1.A1(A_GND1) P1.A12(A_GND2) P1.B1(B_GND1) P1.B12(B_GND2) R19.1 R20.1 U$4.P$5(GND_1) U$4.P$11(GND_2) U$4.P$20(GND_3) U$4.P$21(GND_4) ; also sheet 1,2,3,4,5,6,9,10,11,12,13,14,15,16,17,18,19,20
TP_USB_TYPC_SBU1_CONN: P1.A8(SBU1)
TP_USB_TYPC_SBU2_CONN: P1.B8(SBU2)
USB2_0_DN: U$24.B1(OUT2) ; also sheet 1
USB2_0_DP: U$24.A1(OUT1) ; also sheet 1
USB3_0_MUX1_RX_DN: U$4.P$16(RX1-) U$7.P3_1 U$7.P3_2 U$7.P3_3
USB3_0_MUX1_RX_DP: U$4.P$17(RX1+) U$7.P4_1 U$7.P4_2 U$7.P4_3
USB3_0_MUX1_TX_DN: U$4.P$18(TX1-) U$6.P3_1 U$6.P3_2 U$6.P3_3
USB3_0_MUX1_TX_DP: U$4.P$19(TX1+) U$6.P4_1 U$6.P4_2 U$6.P4_3
USB3_0_MUX2_RX_DN: U$4.P$12(RX2-) U$10.P3_1 U$10.P3_2 U$10.P3_3
USB3_0_MUX2_RX_DP: U$4.P$13(RX2+) U$10.P4_1 U$10.P4_2 U$10.P4_3
USB3_0_MUX2_TX_DN: U$4.P$14(TX2-) U$8.P3_1 U$8.P3_2 U$8.P3_3
USB3_0_MUX2_TX_DP: U$4.P$15(TX2+) U$8.P4_1 U$8.P4_2 U$8.P4_3
USB3_0_RX_DN: U$4.P$8(RX-) ; also sheet 1
USB3_0_RX_DP: U$4.P$7(RX+) ; also sheet 1
USB3_0_TX_DN: U$4.P$4(TX-) ; also sheet 1
USB3_0_TX_DP: U$4.P$3(TX+) ; also sheet 1
USB_TYPC_CC1: C85.1 FB2.2 ; also sheet 1
USB_TYPC_CC2: C84.1 FB1.2 ; also sheet 1
USB_TYPC_CONN_CC1: FB2.1 P1.A5(CC1) U$32.1
USB_TYPC_CONN_CC2: FB1.1 P1.B5(CC2) U$31.1
USBC_PD: R19.2 U$4.P$2(PD)
USBC_SEL: R21.1 ; also sheet 1
USBC_SEL_R: R20.2 R21.2 U$4.P$9(SEL)
USBC_USB2_0_DN: P1.A7(A_D-) P1.B7(B_D-) U$24.B2(IN2)
USBC_USB2_0_DP: P1.A6(A_D+) P1.B6(B_D+) U$24.A2(IN1)
USBC_USB3_0_MUX1_RX_DN: P1.B10(RX1-) U$7.P2_1 U$7.P2_2 U$7.P2_3
USBC_USB3_0_MUX1_RX_DP: P1.B11(RX1+) U$7.P1_1 U$7.P1_2 U$7.P1_3
USBC_USB3_0_MUX1_TX_DN: P1.A3(TX1-) U$6.P2_1 U$6.P2_2 U$6.P2_3
USBC_USB3_0_MUX1_TX_DP: P1.A2(TX1+) U$6.P1_1 U$6.P1_2 U$6.P1_3
USBC_USB3_0_MUX2_RX_DN: P1.A10(RX2-) U$10.P2_1 U$10.P2_2 U$10.P2_3
USBC_USB3_0_MUX2_RX_DP: P1.A11(RX2+) U$10.P1_1 U$10.P1_2 U$10.P1_3
USBC_USB3_0_MUX2_TX_DN: P1.B3(TX2-) U$8.P2_1 U$8.P2_2 U$8.P2_3
USBC_USB3_0_MUX2_TX_DP: P1.B2(TX2+) U$8.P1_1 U$8.P1_2 U$8.P1_3
Unconnected: CF1.2@2

## Sheet 8 of 20: USB 3.0 Filters
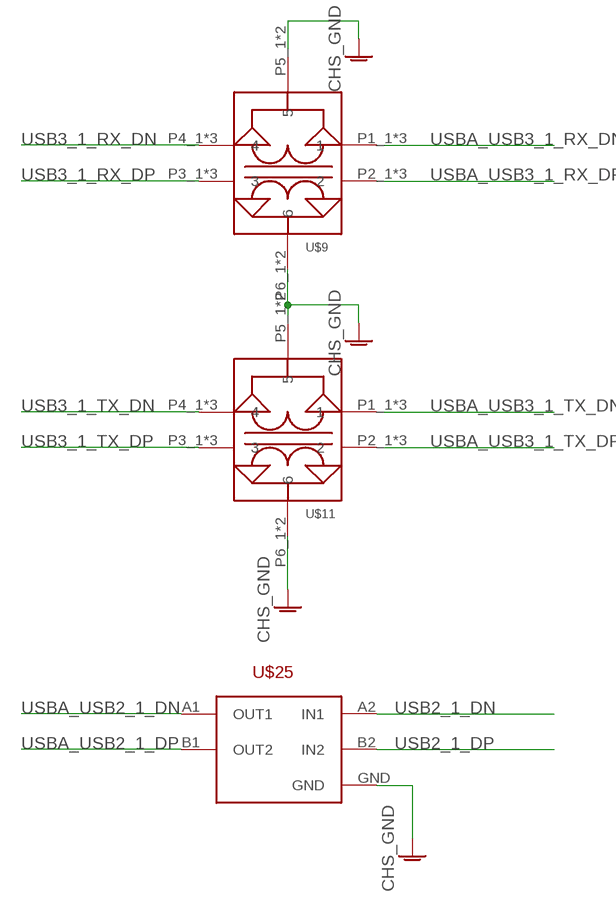
[diagram p7: schematic, sheet 8]

### Parts
U$9  TCE0806S-350-2P-T200  [0302_(0806_METRIC)]
U$11  TCE0806S-350-2P-T200  [0302_(0806_METRIC)]
U$25  ECMF02-2BF3  [5-WLCSP]

### Nets
CHS_GND: U$9.P5_1 U$9.P5_2 U$9.P6_1 U$9.P6_2 U$11.P5_1 U$11.P5_2 U$11.P6_1 U$11.P6_2 U$25.GND ; also sheet 2,7,9,10,12,17
USB2_1_DN: U$25.A2(IN1) ; also sheet 1
USB2_1_DP: U$25.B2(IN2) ; also sheet 1
USB3_1_RX_DN: U$9.P4_1 U$9.P4_2 U$9.P4_3 ; also sheet 1
USB3_1_RX_DP: U$9.P3_1 U$9.P3_2 U$9.P3_3 ; also sheet 1
USB3_1_TX_DN: U$11.P4_1 U$11.P4_2 U$11.P4_3 ; also sheet 1
USB3_1_TX_DP: U$11.P3_1 U$11.P3_2 U$11.P3_3 ; also sheet 1
USBA_USB2_1_DN: U$25.A1(OUT1) ; also sheet 19
USBA_USB2_1_DP: U$25.B1(OUT2) ; also sheet 19
USBA_USB3_1_RX_DN: U$9.P1_1 U$9.P1_2 U$9.P1_3 ; also sheet 19
USBA_USB3_1_RX_DP: U$9.P2_1 U$9.P2_2 U$9.P2_3 ; also sheet 19
USBA_USB3_1_TX_DN: U$11.P1_1 U$11.P1_2 U$11.P1_3 ; also sheet 19
USBA_USB3_1_TX_DP: U$11.P2_1 U$11.P2_2 U$11.P2_3 ; also sheet 19

## Sheet 9 of 20: UART Interfaces
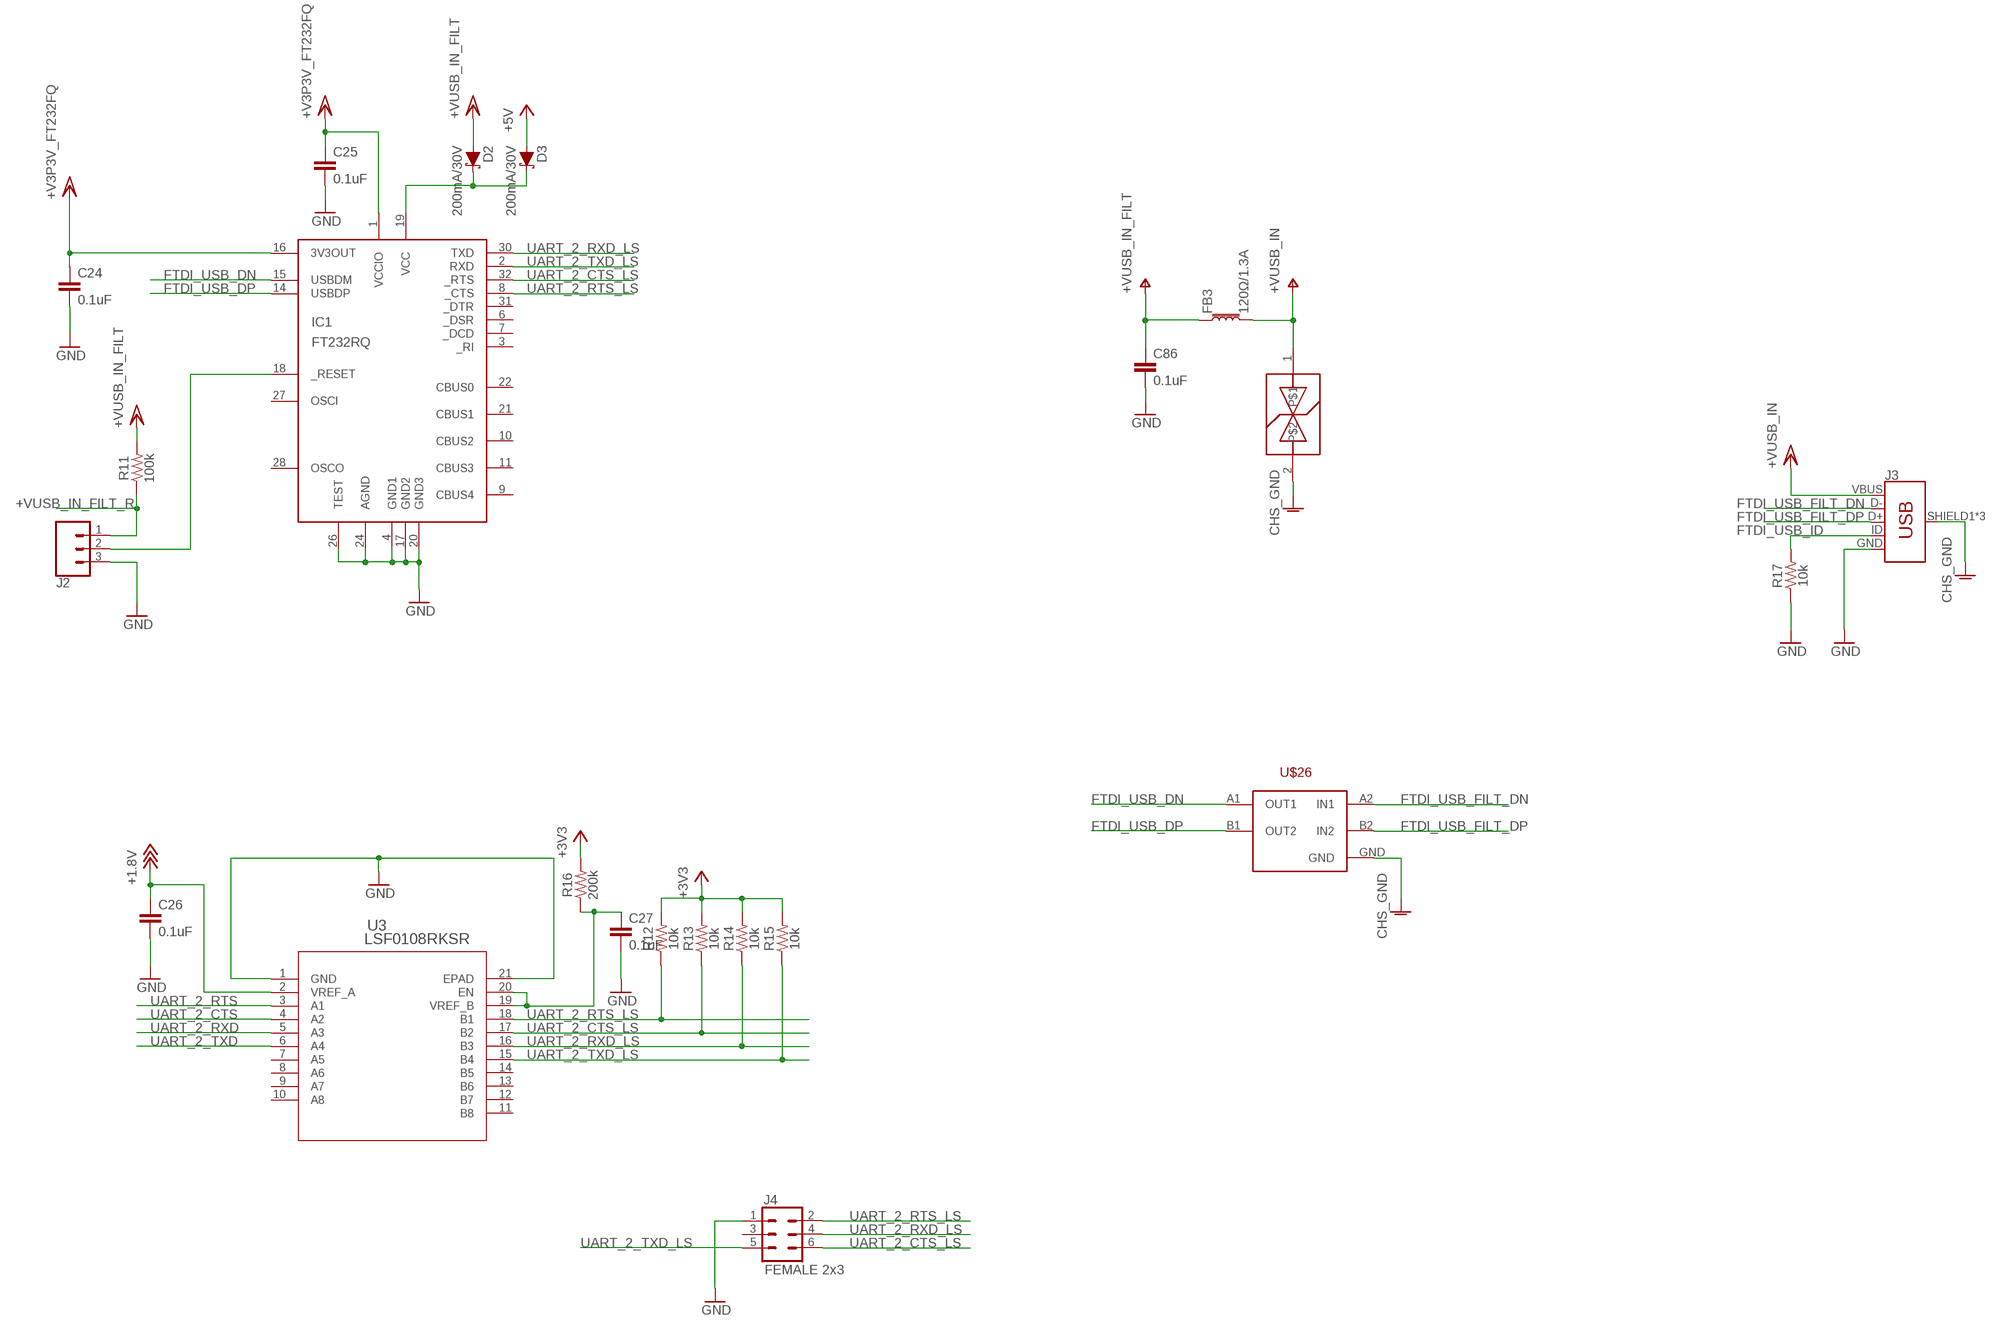
[diagram p8: schematic, sheet 9]

### Parts
C24  0.1uF  0.1UF-0603-25V-(+80/-20%)  [0603]
C25  0.1uF  0.1UF-0603-25V-(+80/-20%)  [0603]
C26  0.1uF  0.1UF-0603-25V-(+80/-20%)  [0603]
C27  0.1uF  0.1UF-0603-25V-(+80/-20%)  [0603]
C86  0.1uF  0.1UF-0603-25V-(+80/-20%)  [0603]
D2  200mA/30V  DIODE-SCHOTTKY-B340A  [SMA-DIODE]
D3  200mA/30V  DIODE-SCHOTTKY-B340A  [SMA-DIODE]
FB3  120Ω/1.3A  FERRITE_BEAD-0603  [0603]
IC1  FT232RQ  [MLF32]
J2  CONN_03  [1X03]
J3  USB_MICRO-B_FEMALE-SMT  [USB-B-MICRO-SMD]
J4  FEMALE 2x3  CONN_03X2FEMALE  [2X3]
R11  100k  100KOHM-0603-1/10W-1%  [0603]
R12  10k  10KOHM-0603-1/10W-1%  [0603]
R13  10k  10KOHM-0603-1/10W-1%  [0603]
R14  10k  10KOHM-0603-1/10W-1%  [0603]
R15  10k  10KOHM-0603-1/10W-1%  [0603]
R16  200k  200KOHM-0603-1/10W-1%  [0603]
R17  10k  10KOHM-0603-1/10W-1%  [0603]
U3  LSF0108RKSR  [RKS20_1P1X3P1]
U$26  ECMF02-2BF3  [5-WLCSP]
U$33  LXES15AAA1-100_ESD_SUPPRESSOR  [0402]

### Nets
+1.8V: C26.1 U3.2(VREF_A) ; also sheet 6,10,11,13,15
+3V3: R12.2 R13.2 R14.2 R15.2 R16.2 ; also sheet 5,7,10,11,13,15,17,18,19,20
+5V: D3.A ; also sheet 4,12,14,15,17,18,19
+V3P3V_FT23RQ: C24.1 C25.1 IC1.1(VCCIO) IC1.16(3V3OUT) ; supply symbol labelled +V3P3V_FT232FQ
+VFTDI_VCC_5P0V: D2.C D3.C IC1.19(VCC)
+VUSB_IN: FB3.2 J3.VBUS U$33.1
+VUSB_IN_FILT: C86.1 D2.A FB3.1 R11.2
+VUSB_IN_FILT_R: J2.1 R11.1
CHS_GND: J3.SHIELD1(SHIELD) J3.SHIELD2(SHIELD) J3.SHIELD3(SHIELD) U$26.GND U$33.2 ; also sheet 2,7,8,10,12,17
FTDI_USB_DN: IC1.15(USBDM) U$26.A1(OUT1)
FTDI_USB_DP: IC1.14(USBDP) U$26.B1(OUT2)
FTDI_USB_FILT_DN: J3.D- U$26.A2(IN1)
FTDI_USB_FILT_DP: J3.D+ U$26.B2(IN2)
FTDI_USB_ID: J3.ID R17.2
GND: C24.2 C25.2 C26.2 C27.2 C86.2 IC1.4(GND1) IC1.17(GND2) IC1.20(GND3) IC1.24(AGND) IC1.26(TEST) J2.3 J3.GND J4.1 R17.1 U3.1(GND) U3.21(EPAD) ; also sheet 1,2,3,4,5,6,7,10,11,12,13,14,15,16,17,18,19,20
N$16: C27.1 R16.1 U3.19(VREF_B) U3.20(EN)
RST_FT232RQ_N: IC1.18(_RESET) J2.2
UART_2_CTS: U3.4(A2) ; also sheet 1
UART_2_CTS_LS: IC1.32(_RTS) J4.6 R13.1 U3.17(B2)
UART_2_RTS: U3.3(A1) ; also sheet 1
UART_2_RTS_LS: IC1.8(_CTS) J4.2 R12.1 U3.18(B1)
UART_2_RXD: U3.5(A3) ; also sheet 1
UART_2_RXD_LS: IC1.30(TXD) J4.4 R14.1 U3.16(B3)
UART_2_TXD: U3.6(A4) ; also sheet 1,16
UART_2_TXD_LS: IC1.2(RXD) J4.5 R15.1 U3.15(B4)
Unconnected: IC1.3(_RI) IC1.6(_DSR) IC1.7(_DCD) IC1.9(CBUS4) IC1.10(CBUS2) IC1.11(CBUS3) IC1.21(CBUS1) IC1.22(CBUS0) IC1.27(OSCI) IC1.28(OSCO) IC1.31(_DTR) J4.3 U3.7(A5) U3.8(A6) U3.9(A7) U3.10(A8) U3.11(B8) U3.12(B7) U3.13(B6) U3.14(B5)

## Sheet 10 of 20: Micro SD
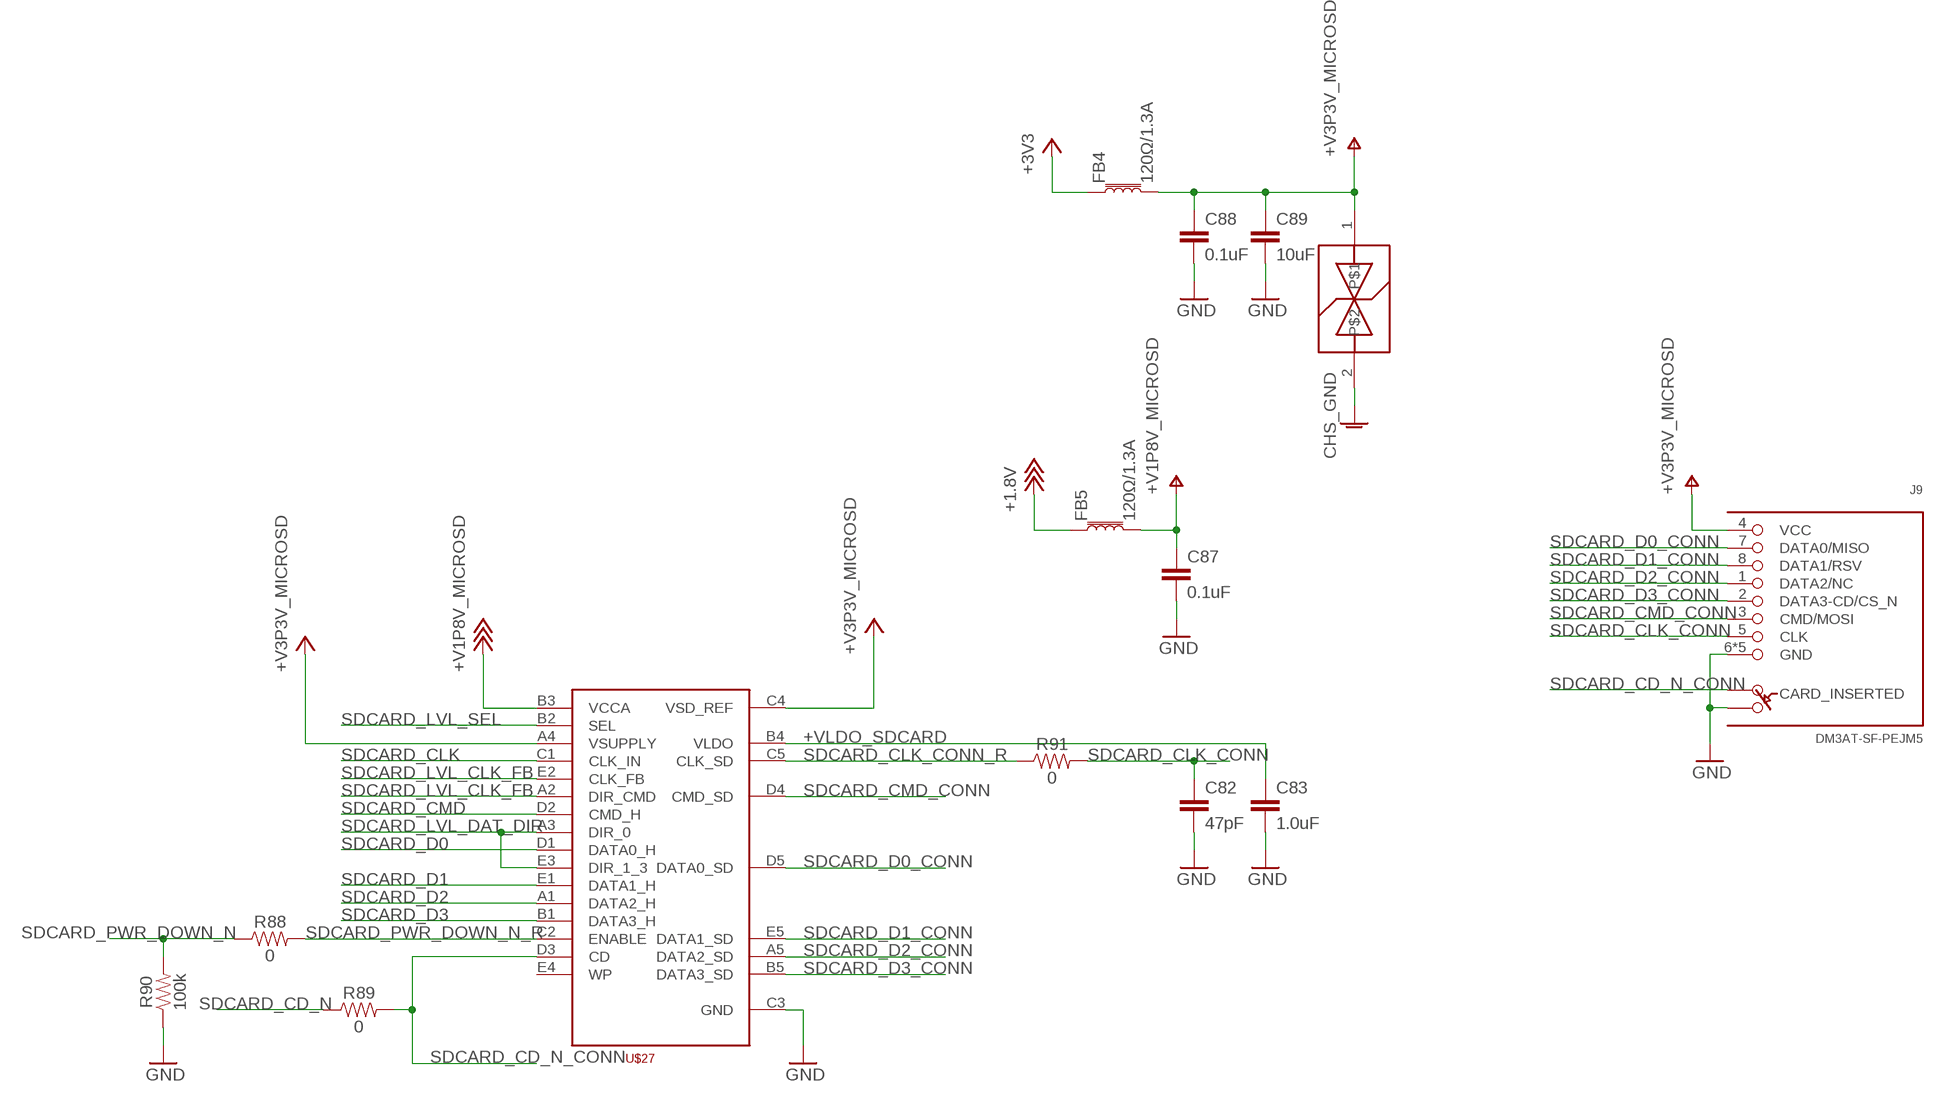
[diagram p9: schematic, sheet 10]

### Parts
C82  47pF  47PF-0603-50V-5%  [0603]
C83  1.0uF  1.0UF-0603-16V-10%  [0603]
C87  0.1uF  0.1UF-0603-25V-(+80/-20%)  [0603]
C88  0.1uF  0.1UF-0603-25V-(+80/-20%)  [0603]
C89  10uF  10UF-0603-6.3V-20%  [0603]
FB4  120Ω/1.3A  FERRITE_BEAD-0603  [0603]
FB5  120Ω/1.3A  FERRITE_BEAD-0603  [0603]
J9  DM3AT-SF-PEJM5  [DM3AT-SF-PEJM5]
R88  0  0OHM-0603-1/10W-5%  [0603]
R89  0  0OHM-0603-1/10W-5%  [0603]
R90  100k  100KOHM-0603-1/10W-1%  [0603]
R91  0  0OHM-0603-1/10W-5%  [0603]
U$27  IP4856CX25  [25-WLCSP]
U$34  LXES15AAA1-100_ESD_SUPPRESSOR  [0402]

### Nets
+1.8V: FB5.1 ; also sheet 6,9,11,13,15
+3V3: FB4.1 ; also sheet 5,7,9,11,13,15,17,18,19,20
+V1P8V_MICROSD: C87.1 FB5.2 U$27.B3(VCCA)
+V3P3V_MICROSD: C88.1 C89.1 FB4.2 J9.4(VCC) U$27.A4(VSUPPLY) U$27.C4(VSD_REF) U$34.1
+VLDO_SDCARD: C83.1 U$27.B4(VLDO)
CHS_GND: U$34.2 ; also sheet 2,7,8,9,12,17
GND: C82.2 C83.2 C87.2 C88.2 C89.2 J9.6(GND) J9.B J9.MOUNT0(GND) J9.MOUNT1(GND) J9.MOUNT2(GND) J9.MOUNT3(GND) R90.1 U$27.C3(GND) ; also sheet 1,2,3,4,5,6,7,9,11,12,13,14,15,16,17,18,19,20
SDCARD_CD_N: R89.1 ; also sheet 1
SDCARD_CD_N_CONN: J9.A R89.2 U$27.D3(CD)
SDCARD_CLK: U$27.C1(CLK_IN) ; also sheet 1
SDCARD_CLK_CONN: C82.1 J9.5(CLK) R91.2
SDCARD_CLK_CONN_R: R91.1 U$27.C5(CLK_SD)
SDCARD_CMD: U$27.D2(CMD_H) ; also sheet 1
SDCARD_CMD_CONN: J9.3(CMD/MOSI) U$27.D4(CMD_SD)
SDCARD_D0: U$27.D1(DATA0_H) ; also sheet 1
SDCARD_D0_CONN: J9.7(DATA0/MISO) U$27.D5(DATA0_SD)
SDCARD_D1: U$27.E1(DATA1_H) ; also sheet 1
SDCARD_D1_CONN: J9.8(DATA1/RSV) U$27.E5(DATA1_SD)
SDCARD_D2: U$27.A1(DATA2_H) ; also sheet 1
SDCARD_D2_CONN: J9.1(DATA2/NC) U$27.A5(DATA2_SD)
SDCARD_D3: U$27.B1(DATA3_H) ; also sheet 1
SDCARD_D3_CONN: J9.2(DATA3-CD/CS_N) U$27.B5(DATA3_SD)
SDCARD_LVL_CLK_FB: U$27.E2(CLK_FB) ; also sheet 1
SDCARD_LVL_CMD_DIR: U$27.A2(DIR_CMD) ; also sheet 1
SDCARD_LVL_DAT_DIR: U$27.A3(DIR_0) U$27.E3(DIR_1_3)
SDCARD_LVL_SEL: U$27.B2(SEL) ; also sheet 1
SDCARD_PWR_DOWN_N: R88.1 R90.2 ; also sheet 1
SDCARD_PWR_DOWN_N_R: R88.2 U$27.C2(ENABLE)
Unconnected: U$27.E4(WP)

## Sheet 11 of 20: HDMI Level Shifter
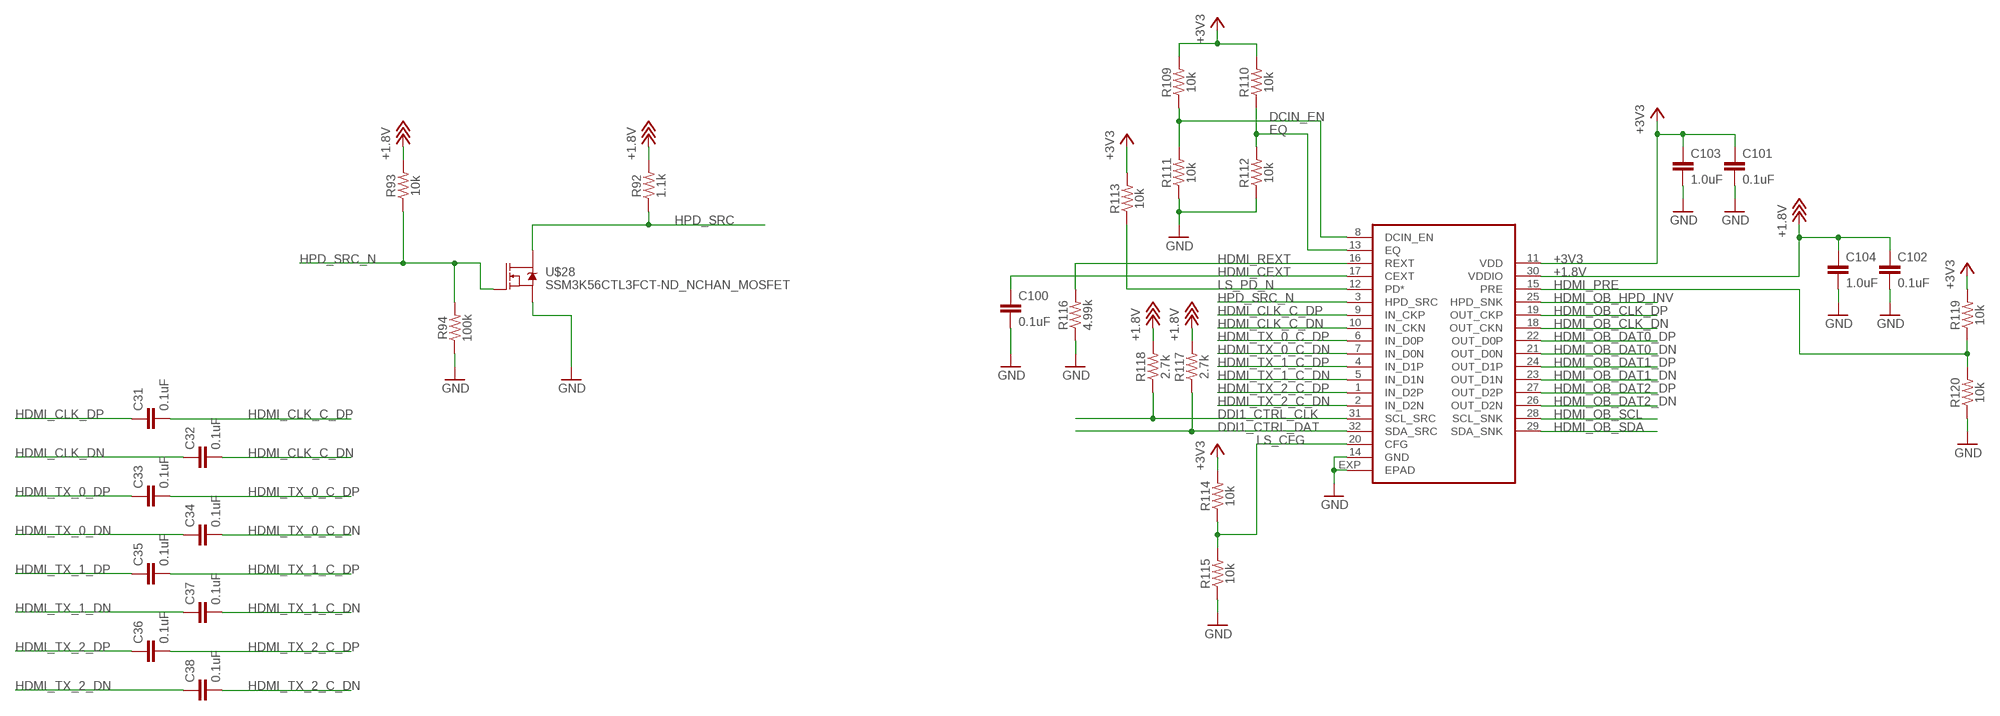
[diagram p10: schematic, sheet 11]

### Parts
C31  0.1uF  0.1UF-0603-25V-(+80/-20%)  [0603]
C32  0.1uF  0.1UF-0603-25V-(+80/-20%)  [0603]
C33  0.1uF  0.1UF-0603-25V-(+80/-20%)  [0603]
C34  0.1uF  0.1UF-0603-25V-(+80/-20%)  [0603]
C35  0.1uF  0.1UF-0603-25V-(+80/-20%)  [0603]
C36  0.1uF  0.1UF-0603-25V-(+80/-20%)  [0603]
C37  0.1uF  0.1UF-0603-25V-(+80/-20%)  [0603]
C38  0.1uF  0.1UF-0603-25V-(+80/-20%)  [0603]
C100  0.1uF  0.1UF-0603-25V-(+80/-20%)  [0603]
C101  0.1uF  0.1UF-0603-25V-(+80/-20%)  [0603]
C102  0.1uF  0.1UF-0603-25V-(+80/-20%)  [0603]
C103  1.0uF  1.0UF-0603-16V-10%  [0603]
C104  1.0uF  1.0UF-0603-16V-10%  [0603]
R92  1.1k  1KOHM-0603-1/10W-1%  [0603]
R93  10k  10KOHM-0603-1/10W-1%  [0603]
R94  100k  100KOHM-0603-1/10W-1%  [0603]
R109  10k  10KOHM-0603-1/10W-1%  [0603]
R110  10k  10KOHM-0603-1/10W-1%  [0603]
R111  10k  10KOHM-0603-1/10W-1%  [0603]
R112  10k  10KOHM-0603-1/10W-1%  [0603]
R113  10k  10KOHM-0603-1/10W-1%  [0603]
R114  10k  10KOHM-0603-1/10W-1%  [0603]
R115  10k  10KOHM-0603-1/10W-1%  [0603]
R116  4.99k  4.7KOHM-0603-1/10W-1%  [0603]
R117  2.7k  2.55KOHM-0603-1/10W-1%  [0603]
R118  2.7k  2.55KOHM-0603-1/10W-1%  [0603]
R119  10k  10KOHM-0603-1/10W-1%  [0603]
R120  10k  10KOHM-0603-1/10W-1%  [0603]
U$28  SSM3K56CTL3FCT-ND_NCHAN_MOSFET  [3-XFDFN]
U$54  PS8203TQFN32GTR-A3  [TQFN32]

### Nets
+1.8V: C102.1 C104.1 R92.2 R93.2 R117.2 R118.2 U$54.30(VDDIO) ; also sheet 6,9,10,13,15
+3V3: C101.1 C103.1 R109.2 R110.2 R113.2 R114.2 R119.2 U$54.11(VDD) ; also sheet 5,7,9,10,13,15,17,18,19,20
DCIN_EN: R109.1 R111.2 U$54.8(DCIN_EN)
DDI1_CTRL_CLK: R118.1 U$54.31(SCL_SRC) ; also sheet 1
DDI1_CTRL_DAT: R117.1 U$54.32(SDA_SRC) ; also sheet 1
EQ: R110.1 R112.2 U$54.13(EQ)
GND: C100.2 C101.2 C102.2 C103.2 C104.2 R94.1 R111.1 R112.1 R115.1 R116.1 R120.1 U$28.P$2(S) U$54.14(GND) U$54.EXP(EPAD) ; also sheet 1,2,3,4,5,6,7,9,10,12,13,14,15,16,17,18,19,20
HDMI_CEXT: C100.1 U$54.17(CEXT)
HDMI_CLK_C_DN: C32.2 U$54.10(IN_CKN)
HDMI_CLK_C_DP: C31.2 U$54.9(IN_CKP)
HDMI_CLK_DN: C32.1 ; also sheet 1
HDMI_CLK_DP: C31.1 ; also sheet 1
HDMI_OB_CLK_DN: U$54.18(OUT_CKN) ; also sheet 12
HDMI_OB_CLK_DP: U$54.19(OUT_CKP) ; also sheet 12
HDMI_OB_DAT0_DN: U$54.21(OUT_D0N) ; also sheet 12
HDMI_OB_DAT0_DP: U$54.22(OUT_D0P) ; also sheet 12
HDMI_OB_DAT1_DN: U$54.23(OUT_D1N) ; also sheet 12
HDMI_OB_DAT1_DP: U$54.24(OUT_D1P) ; also sheet 12
HDMI_OB_DAT2_DN: U$54.26(OUT_D2N) ; also sheet 12
HDMI_OB_DAT2_DP: U$54.27(OUT_D2P) ; also sheet 12
HDMI_OB_HPD_INV: U$54.25(HPD_SNK)
HDMI_OB_SCL: U$54.28(SCL_SNK) ; also sheet 12
HDMI_OB_SDA: U$54.29(SDA_SNK) ; also sheet 12
HDMI_PRE: R119.1 R120.2 U$54.15(PRE)
HDMI_REXT: R116.2 U$54.16(REXT)
HDMI_TX_0_C_DN: C34.2 U$54.7(IN_D0N)
HDMI_TX_0_C_DP: C33.2 U$54.6(IN_D0P)
HDMI_TX_0_DN: C34.1 ; also sheet 1
HDMI_TX_0_DP: C33.1 ; also sheet 1
HDMI_TX_1_C_DN: C37.2 U$54.5(IN_D1N)
HDMI_TX_1_C_DP: C35.2 U$54.4(IN_D1P)
HDMI_TX_1_DN: C37.1 ; also sheet 1
HDMI_TX_1_DP: C35.1 ; also sheet 1
HDMI_TX_2_C_DN: C38.2 U$54.2(IN_D2N)
HDMI_TX_2_C_DP: C36.2 U$54.1(IN_D2P)
HDMI_TX_2_DN: C38.1 ; also sheet 1
HDMI_TX_2_DP: C36.1 ; also sheet 1
HPD_SRC: R92.1 U$28.P$3(D) ; also sheet 1
HPD_SRC_N: R93.1 R94.2 U$28.P$1(G) U$54.3(HPD_SRC)
LS_CFG: R114.1 R115.2 U$54.20(CFG)
LS_PD_N: R113.1 U$54.12(PD*)

## Sheet 12 of 20: HDMI Output
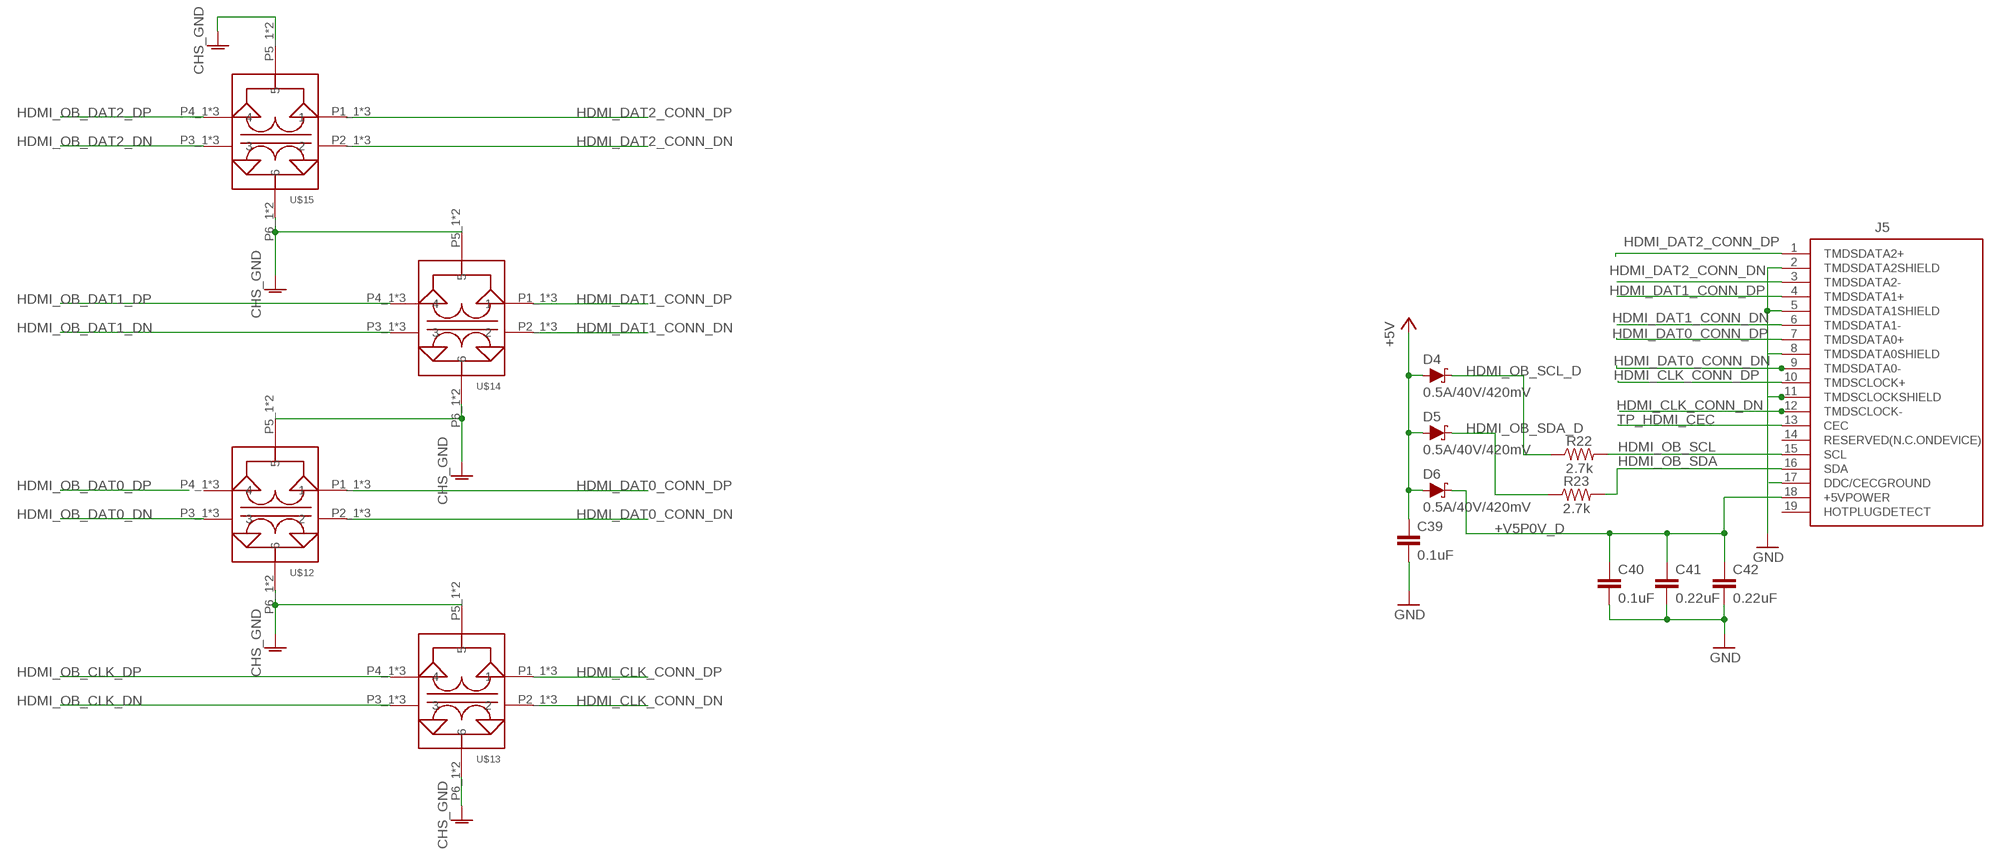
[diagram p11: schematic, sheet 12]

### Parts
C39  0.1uF  0.1UF-0603-25V-(+80/-20%)  [0603]
C40  0.1uF  0.1UF-0603-25V-(+80/-20%)  [0603]
C41  0.22uF  0.22UF-0603-25V-10%  [0603]
C42  0.22uF  0.22UF-0603-25V-10%  [0603]
D4  0.5A/40V/420mV  DIODE-SCHOTTKY-PMEG4005EJ  [SOD-323]
D5  0.5A/40V/420mV  DIODE-SCHOTTKY-PMEG4005EJ  [SOD-323]
D6  0.5A/40V/420mV  DIODE-SCHOTTKY-PMEG4005EJ  [SOD-323]
J5  685119134923  [685119134923]
R22  2.7k  2.55KOHM-0603-1/10W-1%  [0603]
R23  2.7k  2.55KOHM-0603-1/10W-1%  [0603]
U$12  TCE0806G-900-2P-T200  [0302_(0806_METRIC)]
U$13  TCE0806G-900-2P-T200  [0302_(0806_METRIC)]
U$14  TCE0806G-900-2P-T200  [0302_(0806_METRIC)]
U$15  TCE0806G-900-2P-T200  [0302_(0806_METRIC)]

### Nets
+5V: C39.1 D4.A D5.A D6.A ; also sheet 4,9,14,15,17,18,19
+V5P0V_D: C40.1 C41.1 C42.1 D6.C J5.18(+5VPOWER)
CHS_GND: U$12.P5_1 U$12.P5_2 U$12.P6_1 U$12.P6_2 U$13.P5_1 U$13.P5_2 U$13.P6_1 U$13.P6_2 U$14.P5_1 U$14.P5_2 U$14.P6_1 U$14.P6_2 U$15.P5_1 U$15.P5_2 U$15.P6_1 U$15.P6_2 ; also sheet 2,7,8,9,10,17
GND: C39.2 C40.2 C41.2 C42.2 J5.2(TMDSDATA2SHIELD) J5.5(TMDSDATA1SHIELD) J5.8(TMDSDATA0SHIELD) J5.11(TMDSCLOCKSHIELD) ; also sheet 1,2,3,4,5,6,7,9,10,11,13,14,15,16,17,18,19,20
HDMI_CLK_CONN_DN: J5.12(TMDSCLOCK-) U$13.P2_1 U$13.P2_2 U$13.P2_3
HDMI_CLK_CONN_DP: J5.10(TMDSCLOCK+) U$13.P1_1 U$13.P1_2 U$13.P1_3
HDMI_DAT0_CONN_DN: J5.9(TMDSDATA0-) U$12.P2_1 U$12.P2_2 U$12.P2_3
HDMI_DAT0_CONN_DP: J5.7(TMDSDATA0+) U$12.P1_1 U$12.P1_2 U$12.P1_3
HDMI_DAT1_CONN_DN: J5.6(TMDSDATA1-) U$14.P2_1 U$14.P2_2 U$14.P2_3
HDMI_DAT1_CONN_DP: J5.4(TMDSDATA1+) U$14.P1_1 U$14.P1_2 U$14.P1_3
HDMI_DAT2_CONN_DN: J5.3(TMDSDATA2-) U$15.P2_1 U$15.P2_2 U$15.P2_3
HDMI_DAT2_CONN_DP: J5.1(TMDSDATA2+) U$15.P1_1 U$15.P1_2 U$15.P1_3
HDMI_OB_CLK_DN: U$13.P3_1 U$13.P3_2 U$13.P3_3 ; also sheet 11
HDMI_OB_CLK_DP: U$13.P4_1 U$13.P4_2 U$13.P4_3 ; also sheet 11
HDMI_OB_DAT0_DN: U$12.P3_1 U$12.P3_2 U$12.P3_3 ; also sheet 11
HDMI_OB_DAT1_DN: U$14.P3_1 U$14.P3_2 U$14.P3_3 ; also sheet 11
HDMI_OB_DAT1_DP: U$14.P4_1 U$14.P4_2 U$14.P4_3 ; also sheet 11
HDMI_OB_DAT2_DN: U$15.P3_1 U$15.P3_2 U$15.P3_3 ; also sheet 11
HDMI_OB_DAT2_DP: U$15.P4_1 U$15.P4_2 U$15.P4_3 ; also sheet 11
HDMI_OB_SCL: J5.15(SCL) R22.2 ; also sheet 11
HDMI_OB_SCL_D: D4.C R22.1
HDMI_OB_SDA: J5.16(SDA) R23.2 ; also sheet 11
HDMI_OB_SDA_D: D5.C R23.1
N$4: J5.17(DDC/CECGROUND)
TP_HDMI_CEC: J5.13(CEC)
Unconnected: J5.14(RESERVED(N.C.ONDEVICE)) J5.19(HOTPLUGDETECT) U$12.P4_1 U$12.P4_2 U$12.P4_3

## Sheet 13 of 20: Breakout #1 Level Shifters
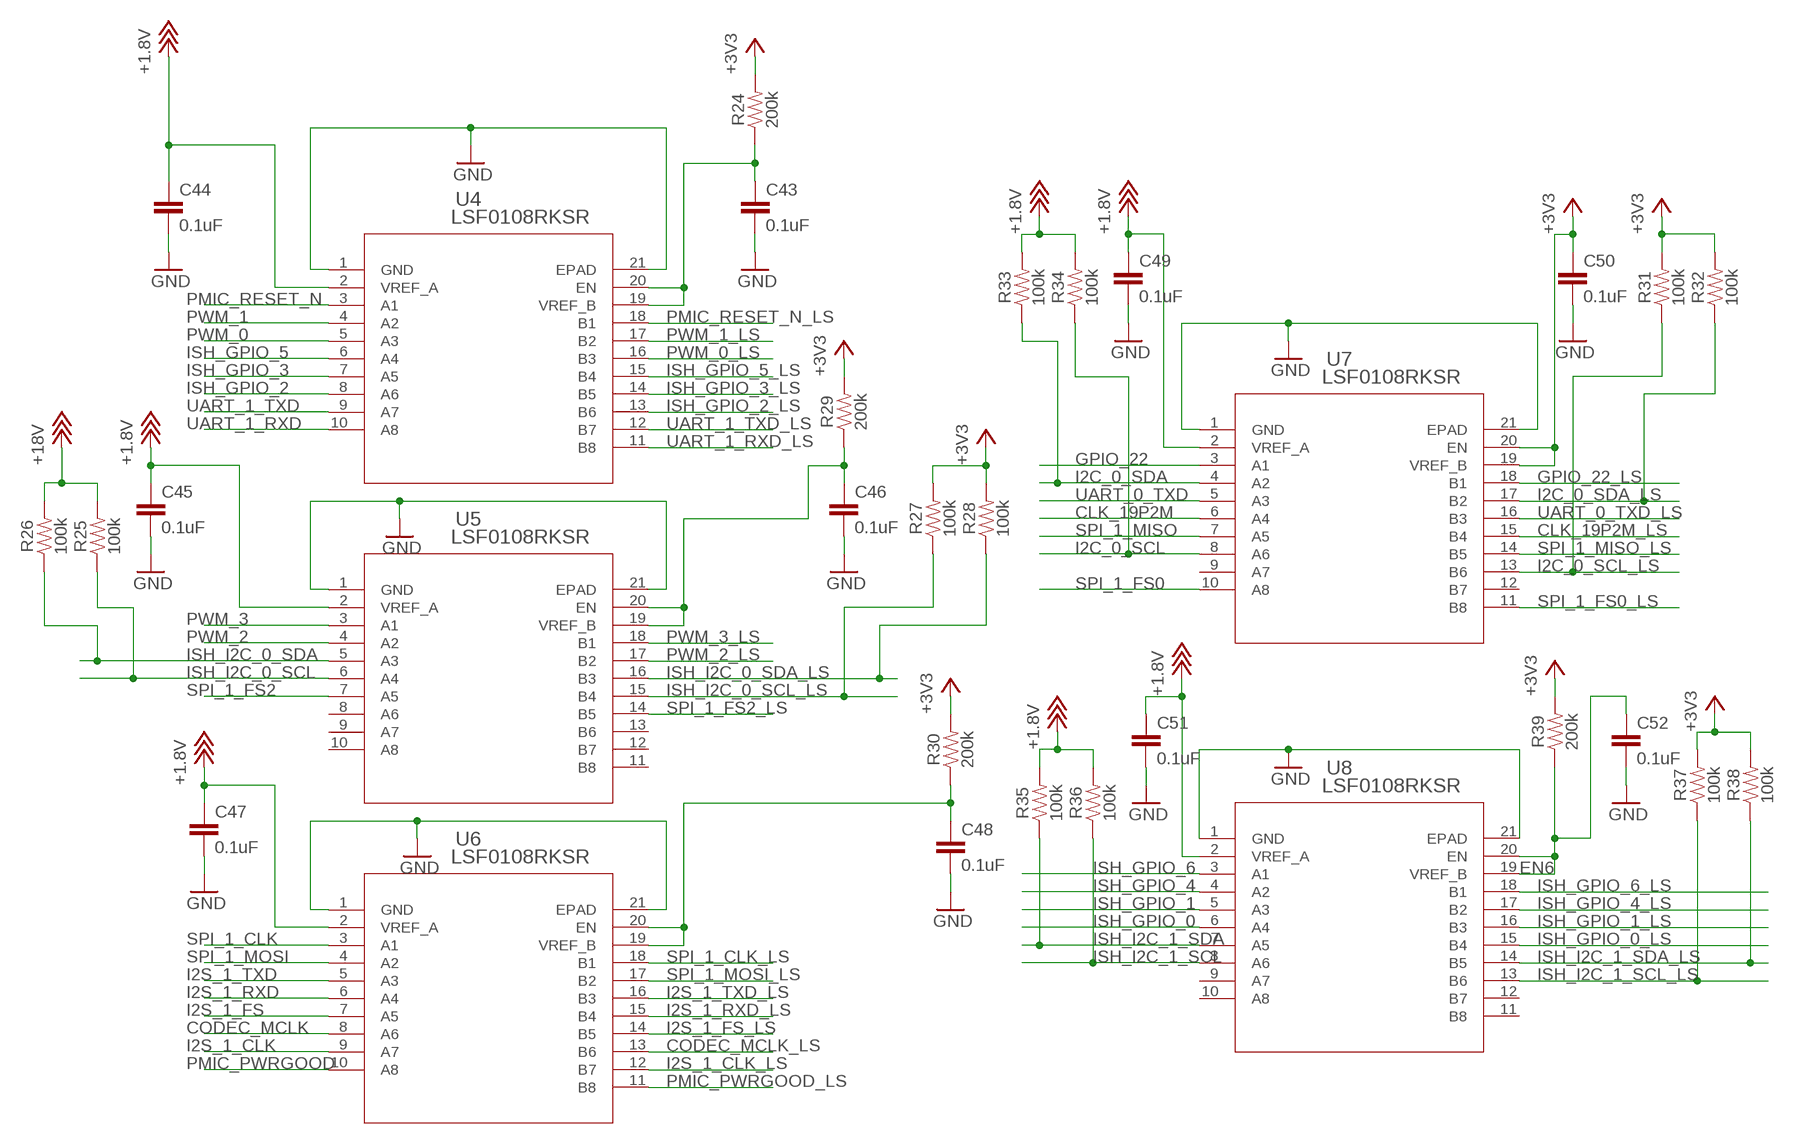
[diagram p12: schematic, sheet 13]

### Parts
C43  0.1uF  0.1UF-0603-25V-(+80/-20%)  [0603]
C44  0.1uF  0.1UF-0603-25V-(+80/-20%)  [0603]
C45  0.1uF  0.1UF-0603-25V-(+80/-20%)  [0603]
C46  0.1uF  0.1UF-0603-25V-(+80/-20%)  [0603]
C47  0.1uF  0.1UF-0603-25V-(+80/-20%)  [0603]
C48  0.1uF  0.1UF-0603-25V-(+80/-20%)  [0603]
C49  0.1uF  0.1UF-0603-25V-(+80/-20%)  [0603]
C50  0.1uF  0.1UF-0603-25V-(+80/-20%)  [0603]
C51  0.1uF  0.1UF-0603-25V-(+80/-20%)  [0603]
C52  0.1uF  0.1UF-0603-25V-(+80/-20%)  [0603]
R24  200k  200KOHM-0603-1/10W-1%  [0603]
R25  100k  100KOHM-0603-1/10W-1%  [0603]
R26  100k  100KOHM-0603-1/10W-1%  [0603]
R27  100k  100KOHM-0603-1/10W-1%  [0603]
R28  100k  100KOHM-0603-1/10W-1%  [0603]
R29  200k  200KOHM-0603-1/10W-1%  [0603]
R30  200k  200KOHM-0603-1/10W-1%  [0603]
R31  100k  100KOHM-0603-1/10W-1%  [0603]
R32  100k  100KOHM-0603-1/10W-1%  [0603]
R33  100k  100KOHM-0603-1/10W-1%  [0603]
R34  100k  100KOHM-0603-1/10W-1%  [0603]
R35  100k  100KOHM-0603-1/10W-1%  [0603]
R36  100k  100KOHM-0603-1/10W-1%  [0603]
R37  100k  100KOHM-0603-1/10W-1%  [0603]
R38  100k  100KOHM-0603-1/10W-1%  [0603]
R39  200k  200KOHM-0603-1/10W-1%  [0603]
U4  LSF0108RKSR  [RKS20_1P1X3P1]
U5  LSF0108RKSR  [RKS20_1P1X3P1]
U6  LSF0108RKSR  [RKS20_1P1X3P1]
U7  LSF0108RKSR  [RKS20_1P1X3P1]
U8  LSF0108RKSR  [RKS20_1P1X3P1]

### Nets
+1.8V: C44.1 C45.1 C47.1 C49.1 C51.1 R25.2 R26.2 R33.2 R34.2 R35.2 R36.2 U4.2(VREF_A) U5.2(VREF_A) U6.2(VREF_A) U7.2(VREF_A) U8.2(VREF_A) ; supply symbol labelled +18V ; also sheet 6,9,10,11,15
+3V3: C50.1 R24.2 R27.2 R28.2 R29.2 R30.2 R31.2 R32.2 R37.2 R38.2 R39.2 U7.19(VREF_B) U7.20(EN) ; also sheet 5,7,9,10,11,15,17,18,19,20
CLK_19P2M: U7.6(A4) ; also sheet 1
CLK_19P2M_LS: U7.15(B4) ; also sheet 14
CODEC_MCLK: U6.8(A6) ; also sheet 1
CODEC_MCLK_LS: U6.13(B6) ; also sheet 14
EN6: C52.1 R39.1 U8.19(VREF_B) U8.20(EN)
GND: C43.2 C44.2 C45.2 C46.2 C47.2 C48.2 C49.2 C50.2 C51.2 C52.2 U4.1(GND) U4.21(EPAD) U5.1(GND) U5.21(EPAD) U6.1(GND) U6.21(EPAD) U7.1(GND) U7.21(EPAD) U8.1(GND) U8.21(EPAD) ; also sheet 1,2,3,4,5,6,7,9,10,11,12,14,15,16,17,18,19,20
GPIO_22: U7.3(A1) ; also sheet 1
GPIO_22_LS: U7.18(B1) ; also sheet 14
I2C_0_SCL: R34.1 U7.8(A6) ; also sheet 1,3,17
I2C_0_SCL_LS: R31.1 U7.13(B6) ; also sheet 14
I2C_0_SDA: R33.1 U7.4(A2) ; also sheet 1,3,17
I2C_0_SDA_LS: R32.1 U7.17(B2) ; also sheet 14
I2S_1_CLK: U6.9(A7) ; also sheet 1
I2S_1_CLK_LS: U6.12(B7) ; also sheet 14
I2S_1_FS: U6.7(A5) ; also sheet 1
I2S_1_FS_LS: U6.14(B5) ; also sheet 14
I2S_1_RXD: U6.6(A4) ; also sheet 1
I2S_1_RXD_LS: U6.15(B4) ; also sheet 14
I2S_1_TXD: U6.5(A3) ; also sheet 1
I2S_1_TXD_LS: U6.16(B3) ; also sheet 14
ISH_GPIO_0: U8.6(A4) ; also sheet 1,14
ISH_GPIO_0_LS: U8.15(B4) ; also sheet 14
ISH_GPIO_1: U8.5(A3) ; also sheet 1,14
ISH_GPIO_1_LS: U8.16(B3) ; also sheet 14
ISH_GPIO_2: U4.8(A6) ; also sheet 1,14
ISH_GPIO_2_LS: U4.13(B6) ; also sheet 14
ISH_GPIO_3: U4.7(A5) ; also sheet 1,14
ISH_GPIO_3_LS: U4.14(B5) ; also sheet 14
ISH_GPIO_4: U8.4(A2) ; also sheet 1
ISH_GPIO_4_LS: U8.17(B2) ; also sheet 14
ISH_GPIO_5: U4.6(A4) ; also sheet 1
ISH_GPIO_5_LS: U4.15(B4) ; also sheet 14
ISH_GPIO_6: U8.3(A1) ; also sheet 1
ISH_GPIO_6_LS: U8.18(B1) ; also sheet 14
ISH_I2C_0_SCL: R25.1 U5.6(A4) ; also sheet 1
ISH_I2C_0_SCL_LS: R27.1 U5.15(B4) ; also sheet 14
ISH_I2C_0_SDA: R26.1 U5.5(A3) ; also sheet 1
ISH_I2C_0_SDA_LS: R28.1 U5.16(B3) ; also sheet 14
ISH_I2C_1_SCL: R36.1 U8.8(A6) ; also sheet 1
ISH_I2C_1_SCL_LS: R37.1 U8.13(B6) ; also sheet 14
ISH_I2C_1_SDA: R35.1 U8.7(A5) ; also sheet 1
ISH_I2C_1_SDA_LS: R38.1 U8.14(B5) ; also sheet 14
N$11: C48.1 R30.1 U6.19(VREF_B) U6.20(EN)
N$12: C46.1 R29.1 U5.19(VREF_B) U5.20(EN)
N$13: C43.1 R24.1 U4.19(VREF_B) U4.20(EN)
PMIC_PWRGOOD: U6.10(A8) ; also sheet 1
PMIC_PWRGOOD_LS: U6.11(B8) ; also sheet 14
PMIC_RESET_N: U4.3(A1) ; also sheet 1
PMIC_RESET_N_LS: U4.18(B1) ; also sheet 14
PWM_0: U4.5(A3) ; also sheet 1
PWM_0_LS: U4.16(B3) ; also sheet 14
PWM_1: U4.4(A2) ; also sheet 1
PWM_1_LS: U4.17(B2) ; also sheet 14
PWM_2: U5.4(A2) ; also sheet 1
PWM_2_LS: U5.17(B2) ; also sheet 14
PWM_3: U5.3(A1) ; also sheet 1
PWM_3_LS: U5.18(B1) ; also sheet 14
SPI_1_CLK: U6.3(A1) ; also sheet 1
SPI_1_CLK_LS: U6.18(B1) ; also sheet 14
SPI_1_FS0: U7.10(A8) ; also sheet 1
SPI_1_FS0_LS: U7.11(B8) ; also sheet 14
SPI_1_FS2: U5.7(A5) ; also sheet 1,16
SPI_1_FS2_LS: U5.14(B5) ; also sheet 14
SPI_1_MISO: U7.7(A5) ; also sheet 1
SPI_1_MISO_LS: U7.14(B5) ; also sheet 14
SPI_1_MOSI: U6.4(A2) ; also sheet 1
SPI_1_MOSI_LS: U6.17(B2) ; also sheet 14
UART_0_TXD: U7.5(A3) ; also sheet 1
UART_0_TXD_LS: U7.16(B3) ; also sheet 14,18
UART_1_RXD: U4.10(A8) ; also sheet 1
UART_1_RXD_LS: U4.11(B8) ; also sheet 14
UART_1_TXD: U4.9(A7) ; also sheet 1,16
UART_1_TXD_LS: U4.12(B7) ; also sheet 14
Unconnected: U5.8(A6) U5.9(A7) U5.10(A8) U5.11(B8) U5.12(B7) U5.13(B6) U7.9(A7) U7.12(B7) U8.9(A7) U8.10(A8) U8.11(B8) U8.12(B7)

## Sheet 14 of 20: I/O Breakout #1
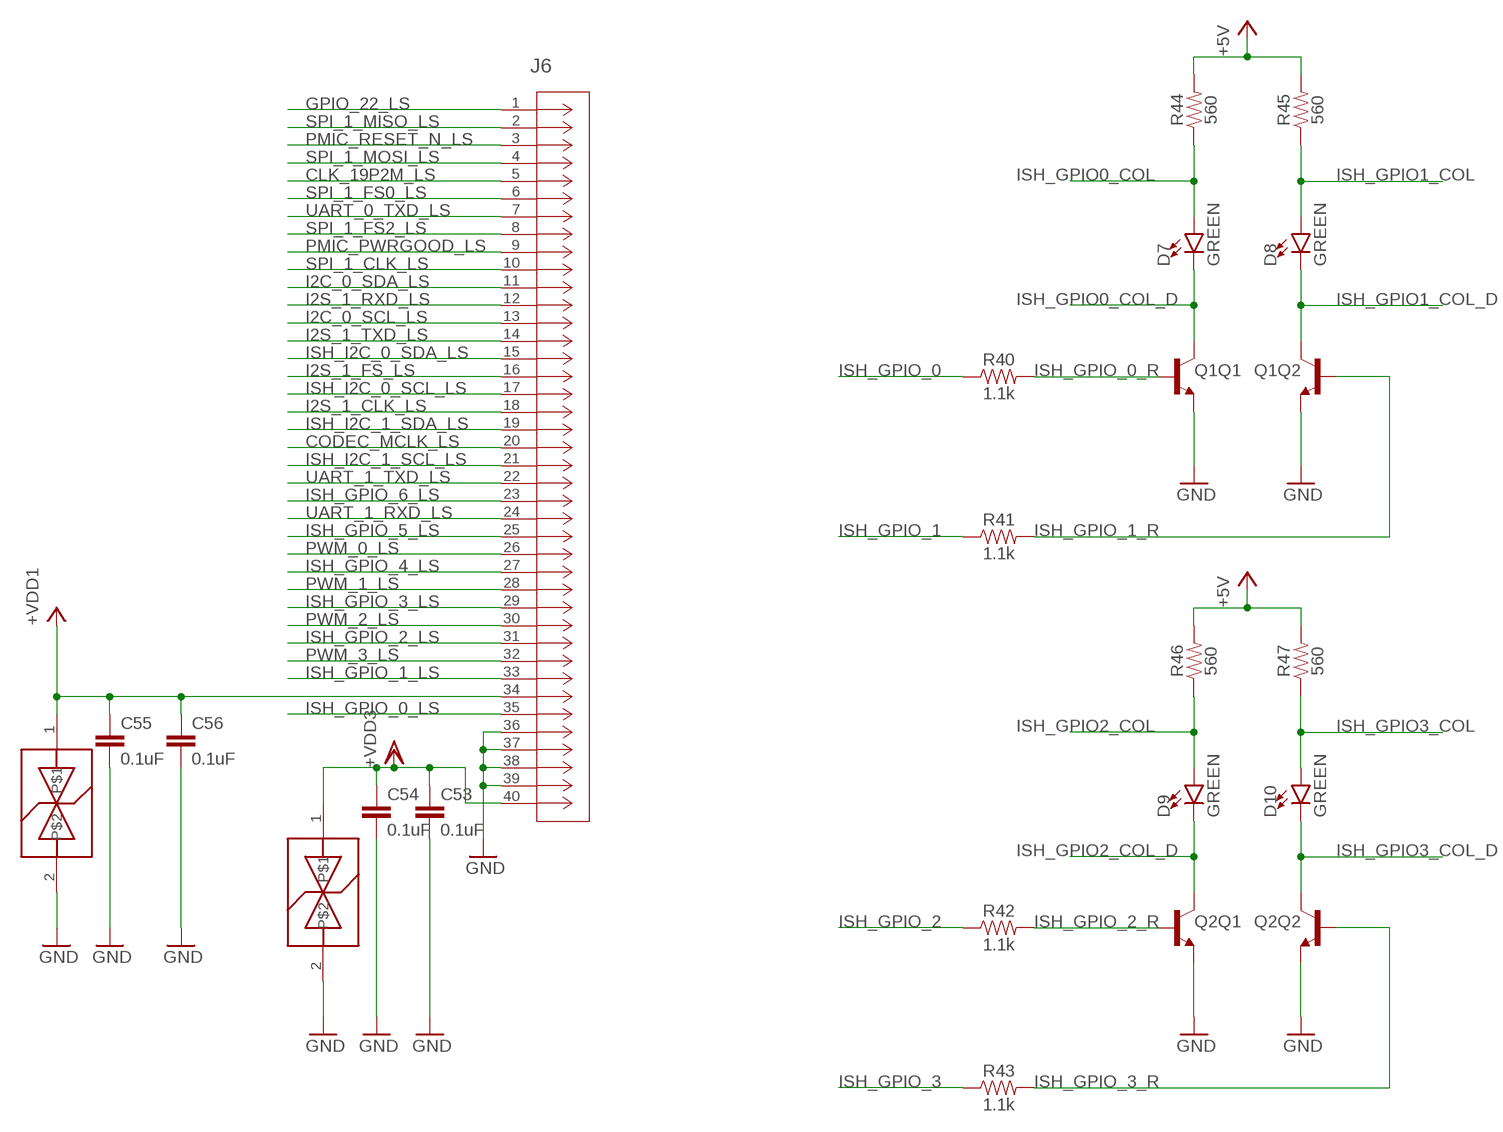
[diagram p13: schematic, sheet 14]

### Parts
C53  0.1uF  0.1UF-0603-25V-(+80/-20%)  [0603]
C54  0.1uF  0.1UF-0603-25V-(+80/-20%)  [0603]
C55  0.1uF  0.1UF-0603-25V-(+80/-20%)  [0603]
C56  0.1uF  0.1UF-0603-25V-(+80/-20%)  [0603]
D7  GREEN  LED-GREEN0603  [LED-0603]
D8  GREEN  LED-GREEN0603  [LED-0603]
D9  GREEN  LED-GREEN0603  [LED-0603]
D10  GREEN  LED-GREEN0603  [LED-0603]
J6  SSM-120-S-DV  [CON40_2X20_DU_SSM]
Q1  TRANS_NPN_DUAL-MBT3904DW1T1  [SC70-6]
Q2  TRANS_NPN_DUAL-MBT3904DW1T1  [SC70-6]
R40  1.1k  1.5KOHM-0603-1/10W-1%  [0603]
R41  1.1k  1.5KOHM-0603-1/10W-1%  [0603]
R42  1.1k  1.5KOHM-0603-1/10W-1%  [0603]
R43  1.1k  1.5KOHM-0603-1/10W-1%  [0603]
R44  560  510OHM-2010-1/2W-5%  [2010]
R45  560  510OHM-2010-1/2W-5%  [2010]
R46  560  510OHM-2010-1/2W-5%  [2010]
R47  560  510OHM-2010-1/2W-5%  [2010]
U$35  LXES15AAA1-100_ESD_SUPPRESSOR  [0402]
U$36  LXES15AAA1-100_ESD_SUPPRESSOR  [0402]

### Nets
+5V: R44.2 R45.2 R46.2 R47.2 ; also sheet 4,9,12,15,17,18,19
+VDD1: C55.1 C56.1 J6.34 U$35.1 ; also sheet 1,6,16,17
+VDD3: C53.1 C54.1 J6.40 U$36.1 ; also sheet 1,4,5
CLK_19P2M_LS: J6.5 ; also sheet 13
CODEC_MCLK_LS: J6.20 ; also sheet 13
GND: C53.2 C54.2 C55.2 C56.2 J6.36 J6.37 J6.38 J6.39 Q1.1(Q2:E) Q1.4(Q1:E) Q2.1(Q2:E) Q2.4(Q1:E) U$35.2 U$36.2 ; also sheet 1,2,3,4,5,6,7,9,10,11,12,13,15,16,17,18,19,20
GPIO_22_LS: J6.1 ; also sheet 13
I2C_0_SCL_LS: J6.13 ; also sheet 13
I2C_0_SDA_LS: J6.11 ; also sheet 13
I2S_1_CLK_LS: J6.18 ; also sheet 13
I2S_1_FS_LS: J6.16 ; also sheet 13
I2S_1_RXD_LS: J6.12 ; also sheet 13
I2S_1_TXD_LS: J6.14 ; also sheet 13
ISH_GPIO0_COL: D7.A R44.1
ISH_GPIO0_COL_D: D7.C Q1.3(Q1:C)
ISH_GPIO1_COL: D8.A R45.1
ISH_GPIO1_COL_D: D8.C Q1.6(Q2:C)
ISH_GPIO2_COL: D9.A R46.1
ISH_GPIO2_COL_D: D9.C Q2.3(Q1:C)
ISH_GPIO3_COL: D10.A R47.1
ISH_GPIO3_COL_D: D10.C Q2.6(Q2:C)
ISH_GPIO_0: R40.1 ; also sheet 1,13
ISH_GPIO_0_LS: J6.35 ; also sheet 13
ISH_GPIO_0_R: Q1.5(Q1:B) R40.2
ISH_GPIO_1: R41.1 ; also sheet 1,13
ISH_GPIO_1_LS: J6.33 ; also sheet 13
ISH_GPIO_1_R: Q1.2(Q2:B) R41.2
ISH_GPIO_2: R42.1 ; also sheet 1,13
ISH_GPIO_2_LS: J6.31 ; also sheet 13
ISH_GPIO_2_R: Q2.5(Q1:B) R42.2
ISH_GPIO_3: R43.1 ; also sheet 1,13
ISH_GPIO_3_LS: J6.29 ; also sheet 13
ISH_GPIO_3_R: Q2.2(Q2:B) R43.2
ISH_GPIO_4_LS: J6.27 ; also sheet 13
ISH_GPIO_5_LS: J6.25 ; also sheet 13
ISH_GPIO_6_LS: J6.23 ; also sheet 13
ISH_I2C_0_SCL_LS: J6.17 ; also sheet 13
ISH_I2C_0_SDA_LS: J6.15 ; also sheet 13
ISH_I2C_1_SCL_LS: J6.21 ; also sheet 13
ISH_I2C_1_SDA_LS: J6.19 ; also sheet 13
PMIC_PWRGOOD_LS: J6.9 ; also sheet 13
PMIC_RESET_N_LS: J6.3 ; also sheet 13
PWM_0_LS: J6.26 ; also sheet 13
PWM_1_LS: J6.28 ; also sheet 13
PWM_2_LS: J6.30 ; also sheet 13
PWM_3_LS: J6.32 ; also sheet 13
SPI_1_CLK_LS: J6.10 ; also sheet 13
SPI_1_FS0_LS: J6.6 ; also sheet 13
SPI_1_FS2_LS: J6.8 ; also sheet 13
SPI_1_MISO_LS: J6.2 ; also sheet 13
SPI_1_MOSI_LS: J6.4 ; also sheet 13
UART_0_TXD_LS: J6.7 ; also sheet 13,18
UART_1_RXD_LS: J6.24 ; also sheet 13
UART_1_TXD_LS: J6.22 ; also sheet 13

## Sheet 15 of 20: Breakout #2 Level Shifter + I/O
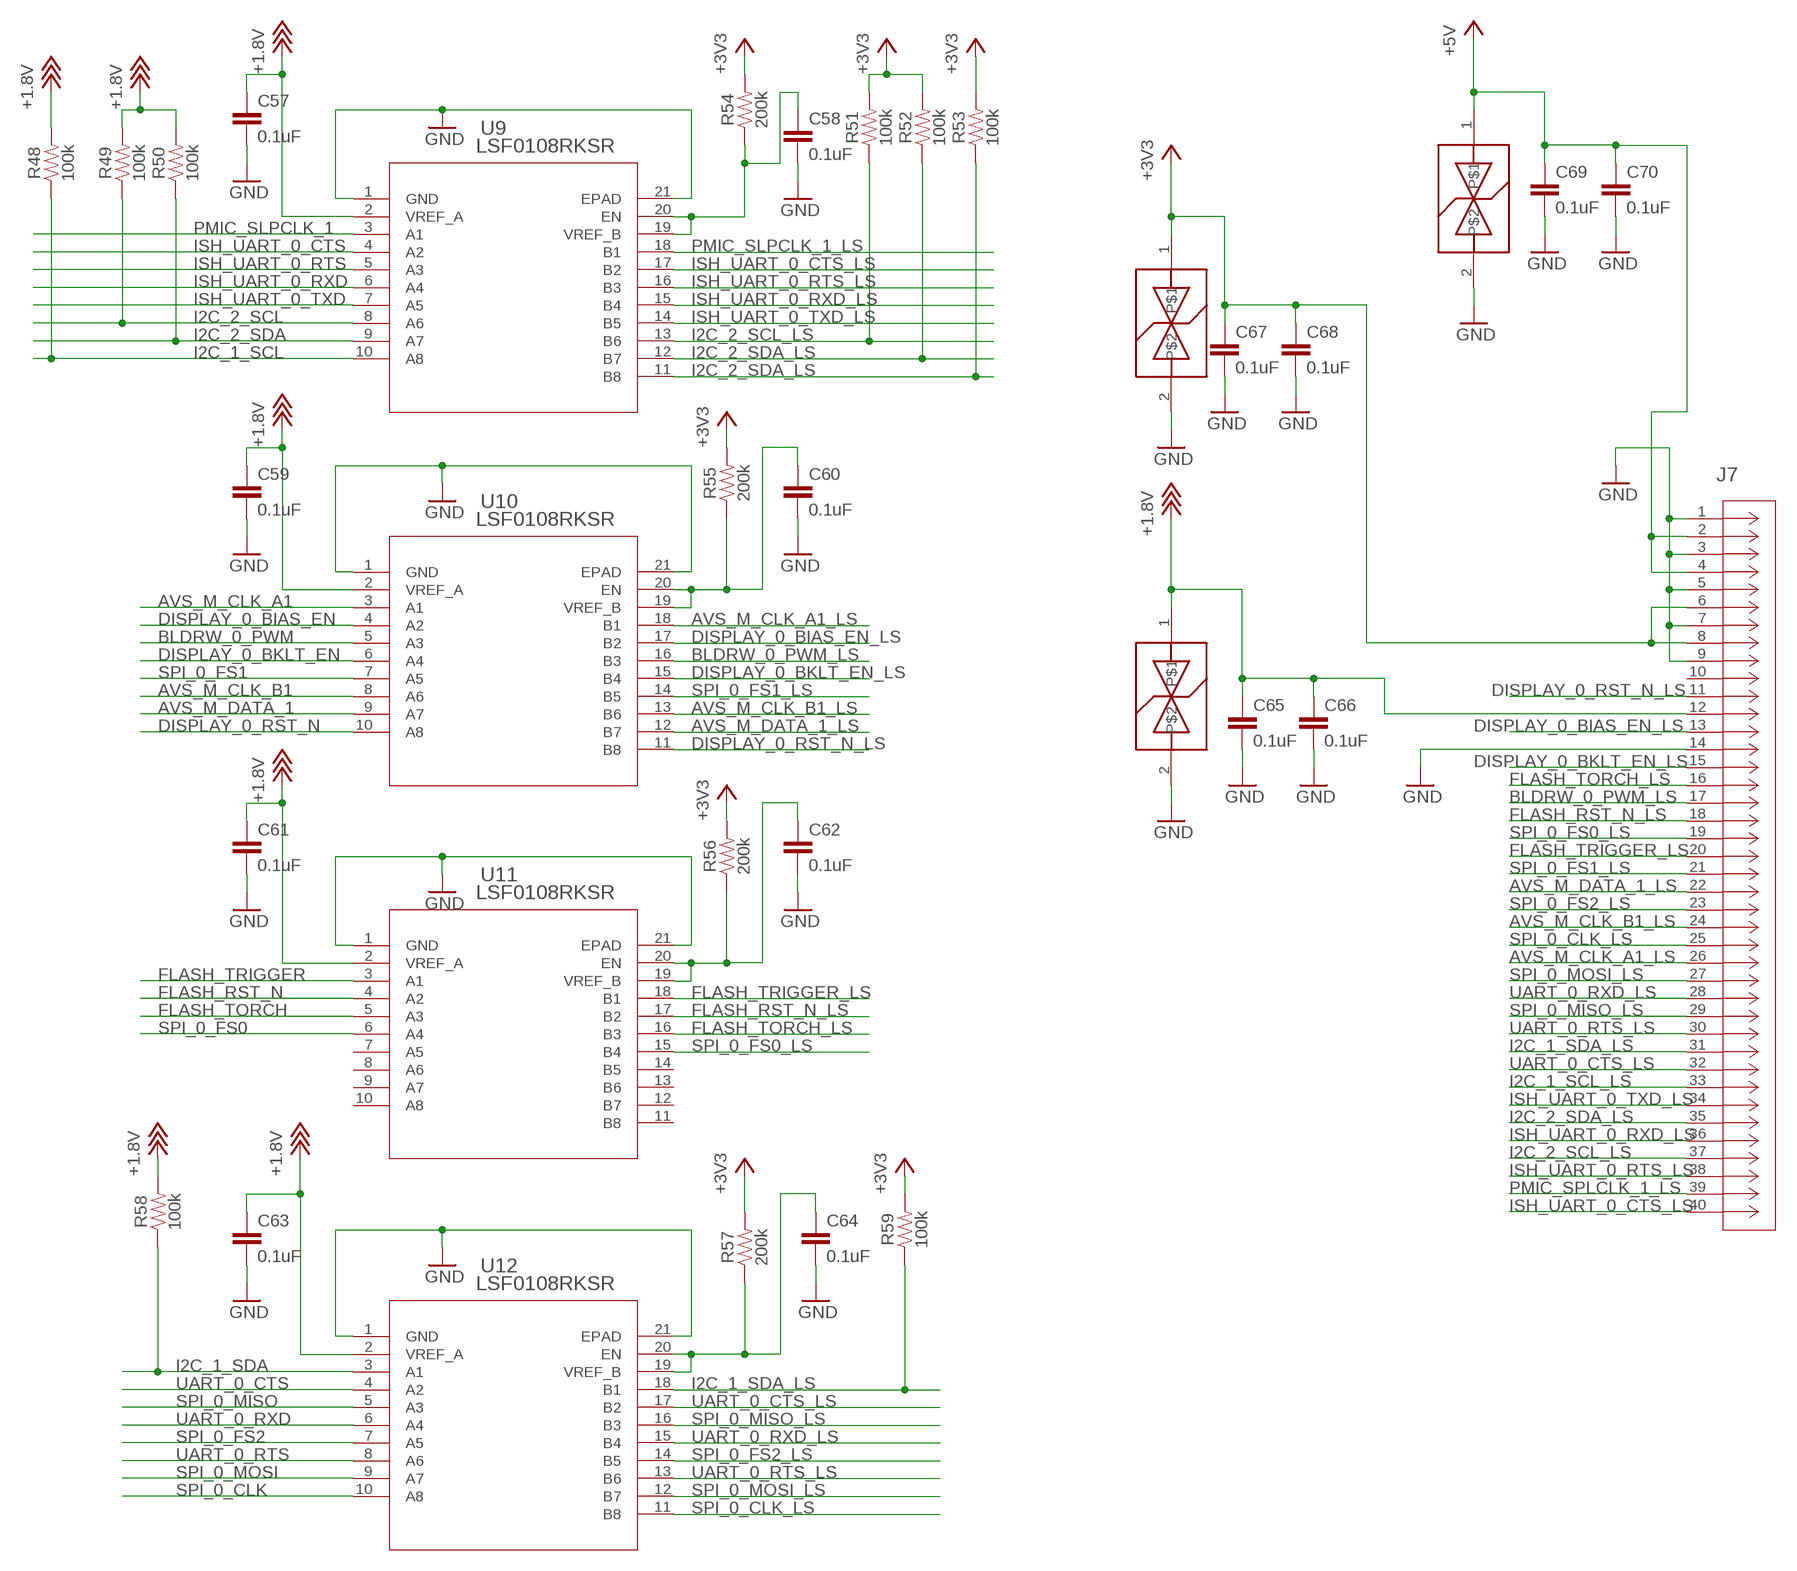
[diagram p14: schematic, sheet 15]

### Parts
C57  0.1uF  0.1UF-0603-25V-(+80/-20%)  [0603]
C58  0.1uF  0.1UF-0603-25V-(+80/-20%)  [0603]
C59  0.1uF  0.1UF-0603-25V-(+80/-20%)  [0603]
C60  0.1uF  0.1UF-0603-25V-(+80/-20%)  [0603]
C61  0.1uF  0.1UF-0603-25V-(+80/-20%)  [0603]
C62  0.1uF  0.1UF-0603-25V-(+80/-20%)  [0603]
C63  0.1uF  0.1UF-0603-25V-(+80/-20%)  [0603]
C64  0.1uF  0.1UF-0603-25V-(+80/-20%)  [0603]
C65  0.1uF  0.1UF-0603-25V-(+80/-20%)  [0603]
C66  0.1uF  0.1UF-0603-25V-(+80/-20%)  [0603]
C67  0.1uF  0.1UF-0603-25V-(+80/-20%)  [0603]
C68  0.1uF  0.1UF-0603-25V-(+80/-20%)  [0603]
C69  0.1uF  0.1UF-0603-25V-(+80/-20%)  [0603]
C70  0.1uF  0.1UF-0603-25V-(+80/-20%)  [0603]
J7  SSM-120-S-DV  [CON40_2X20_DU_SSM]
R48  100k  100KOHM-0603-1/10W-1%  [0603]
R49  100k  100KOHM-0603-1/10W-1%  [0603]
R50  100k  100KOHM-0603-1/10W-1%  [0603]
R51  100k  100KOHM-0603-1/10W-1%  [0603]
R52  100k  100KOHM-0603-1/10W-1%  [0603]
R53  100k  100KOHM-0603-1/10W-1%  [0603]
R54  200k  200KOHM-0603-1/10W-1%  [0603]
R55  200k  200KOHM-0603-1/10W-1%  [0603]
R56  200k  200KOHM-0603-1/10W-1%  [0603]
R57  200k  200KOHM-0603-1/10W-1%  [0603]
R58  100k  100KOHM-0603-1/10W-1%  [0603]
R59  100k  100KOHM-0603-1/10W-1%  [0603]
U9  LSF0108RKSR  [RKS20_1P1X3P1]
U10  LSF0108RKSR  [RKS20_1P1X3P1]
U11  LSF0108RKSR  [RKS20_1P1X3P1]
U12  LSF0108RKSR  [RKS20_1P1X3P1]
U$37  LXES15AAA1-100_ESD_SUPPRESSOR  [0402]
U$38  LXES15AAA1-100_ESD_SUPPRESSOR  [0402]
U$39  LXES15AAA1-100_ESD_SUPPRESSOR  [0402]

### Nets
+1.8V: C57.1 C59.1 C61.1 C63.1 C65.1 C66.1 J7.12 R48.2 R49.2 R50.2 R58.2 U9.2(VREF_A) U10.2(VREF_A) U11.2(VREF_A) U12.2(VREF_A) U$37.1 ; also sheet 6,9,10,11,13
+3V3: C67.1 C68.1 J7.6 J7.8 R51.2 R52.2 R53.2 R54.2 R55.2 R56.2 R57.2 R59.2 U$38.1 ; also sheet 5,7,9,10,11,13,17,18,19,20
+5V: C69.1 C70.1 J7.2 J7.4 U$39.1 ; also sheet 4,9,12,14,17,18,19
AVS_M_CLK_A1: U10.3(A1) ; also sheet 1
AVS_M_CLK_A1_LS: J7.26 U10.18(B1)
AVS_M_CLK_B1: U10.8(A6) ; also sheet 1
AVS_M_CLK_B1_LS: J7.24 U10.13(B6)
AVS_M_DATA_1: U10.9(A7) ; also sheet 1
AVS_M_DATA_1_LS: J7.22 U10.12(B7)
BLDRW_0_PWM: U10.5(A3) ; also sheet 1
BLDRW_0_PWM_LS: J7.17 U10.16(B3)
DISPLAY_0_BIAS_EN: U10.4(A2) ; also sheet 1
DISPLAY_0_BIAS_EN_LS: J7.13 U10.17(B2)
DISPLAY_0_BKLT_EN: U10.6(A4) ; also sheet 1
DISPLAY_0_BKLT_EN_LS: J7.15 U10.15(B4)
DISPLAY_0_RST_N: U10.10(A8) ; also sheet 1
DISPLAY_0_RST_N_LS: J7.11 U10.11(B8)
FLASH_RST_N: U11.4(A2) ; also sheet 1
FLASH_RST_N_LS: J7.18 U11.17(B2)
FLASH_TORCH: U11.5(A3) ; also sheet 1
FLASH_TORCH_LS: J7.16 U11.16(B3)
FLASH_TRIGGER: U11.3(A1) ; also sheet 1
FLASH_TRIGGER_LS: J7.20 U11.18(B1)
GND: C57.2 C58.2 C59.2 C60.2 C61.2 C62.2 C63.2 C64.2 C65.2 C66.2 C67.2 C68.2 C69.2 C70.2 J7.1 J7.3 J7.5 J7.7 J7.9 J7.14 U9.1(GND) U9.21(EPAD) U10.1(GND) U10.21(EPAD) U11.1(GND) U11.21(EPAD) U12.1(GND) U12.21(EPAD) U$37.2 U$38.2 U$39.2 ; also sheet 1,2,3,4,5,6,7,9,10,11,12,13,14,16,17,18,19,20
I2C_1_SCL: R48.1 U9.10(A8) ; also sheet 1
I2C_1_SCL_LS: J7.33
I2C_1_SDA: R58.1 U12.3(A1) ; also sheet 1
I2C_1_SDA_LS: J7.31 R59.1 U12.18(B1)
I2C_2_SCL: R49.1 U9.8(A6) ; also sheet 1
I2C_2_SCL_LS: J7.37 R51.1 U9.13(B6)
I2C_2_SDA: R50.1 U9.9(A7) ; also sheet 1
I2C_2_SDA_LS: J7.35 R52.1 R53.1 U9.11(B8) U9.12(B7)
ISH_UART_0_CTS: U9.4(A2) ; also sheet 1
ISH_UART_0_CTS_LS: J7.40 U9.17(B2)
ISH_UART_0_RTS: U9.5(A3) ; also sheet 1
ISH_UART_0_RTS_LS: J7.38 U9.16(B3)
ISH_UART_0_RXD: U9.6(A4) ; also sheet 1
ISH_UART_0_RXD_LS: J7.36 U9.15(B4)
ISH_UART_0_TXD: U9.7(A5) ; also sheet 1
ISH_UART_0_TXD_LS: J7.34 U9.14(B5)
N$8: C62.1 R56.1 U11.19(VREF_B) U11.20(EN)
N$14: C60.1 R55.1 U10.19(VREF_B) U10.20(EN)
N$17: C64.1 R57.1 U12.19(VREF_B) U12.20(EN)
N$19: C58.1 R54.1 U9.19(VREF_B) U9.20(EN)
PMIC_SLPCLK_1: U9.3(A1) ; also sheet 1
PMIC_SLPCLK_1_LS: U9.18(B1)
PMIC_SPLCLK_1_LS: J7.39
SPI_0_CLK: U12.10(A8) ; also sheet 1
SPI_0_CLK_LS: J7.25 U12.11(B8)
SPI_0_FS0: U11.6(A4) ; also sheet 1
SPI_0_FS0_LS: J7.19 U11.15(B4)
SPI_0_FS1: U10.7(A5) ; also sheet 1
SPI_0_FS1_LS: J7.21 U10.14(B5)
SPI_0_FS2: U12.7(A5) ; also sheet 1
SPI_0_FS2_LS: J7.23 U12.14(B5)
SPI_0_MISO: U12.5(A3) ; also sheet 1
SPI_0_MISO_LS: J7.29 U12.16(B3)
SPI_0_MOSI: U12.9(A7) ; also sheet 1
SPI_0_MOSI_LS: J7.27 U12.12(B7)
UART_0_CTS: U12.4(A2) ; also sheet 1
UART_0_CTS_LS: J7.32 U12.17(B2)
UART_0_RTS: U12.8(A6) ; also sheet 1
UART_0_RTS_LS: J7.30 U12.13(B6)
UART_0_RXD: U12.6(A4) ; also sheet 1
UART_0_RXD_LS: J7.28 U12.15(B4) ; also sheet 18
Unconnected: J7.10 U11.7(A5) U11.8(A6) U11.9(A7) U11.10(A8) U11.11(B8) U11.12(B7) U11.13(B6) U11.14(B5)

## Sheet 16 of 20: Interactive Circuit
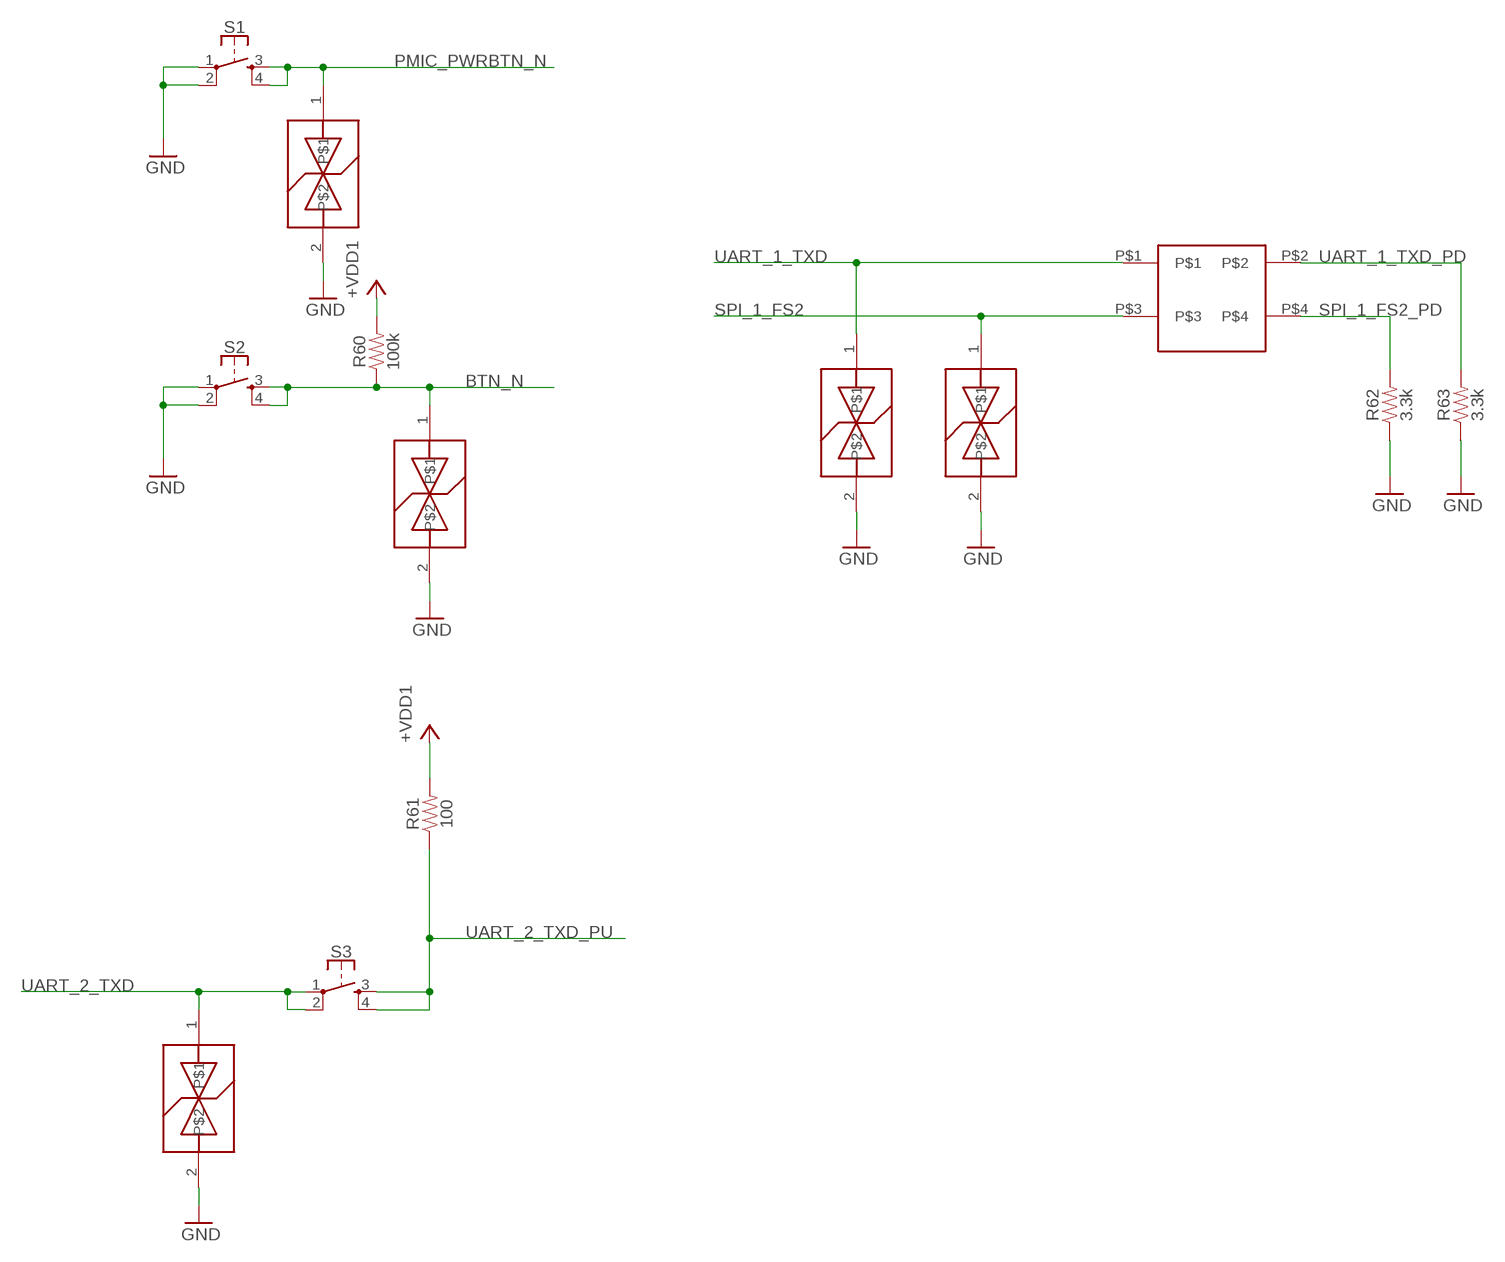
[diagram p15: schematic, sheet 16]

### Parts
R60  100k  100KOHM-0603-1/10W-1%  [0603]
R61  100  100OHM-0603-1/4W-5%  [0603]
R62  3.3k  3.3KOHM-0603-1/10W-1%  [0603]
R63  3.3k  3.3KOHM-0603-1/10W-1%  [0603]
S1  MOMENTARY-SWITCH-SPST-2-SMD-4.6X2.8MM  [TACTILE_SWITCH_SMD_4.6X2.8MM]
S2  MOMENTARY-SWITCH-SPST-2-SMD-4.6X2.8MM  [TACTILE_SWITCH_SMD_4.6X2.8MM]
S3  MOMENTARY-SWITCH-SPST-2-SMD-4.6X2.8MM  [TACTILE_SWITCH_SMD_4.6X2.8MM]
U$16  TSM-102-01-L-DV-TR  [4X-.145X.05_SQ]
U$40  LXES15AAA1-100_ESD_SUPPRESSOR  [0402]
U$41  LXES15AAA1-100_ESD_SUPPRESSOR  [0402]
U$42  LXES15AAA1-100_ESD_SUPPRESSOR  [0402]
U$43  LXES15AAA1-100_ESD_SUPPRESSOR  [0402]
U$44  LXES15AAA1-100_ESD_SUPPRESSOR  [0402]

### Nets
+VDD1: R60.2 R61.2 ; also sheet 1,6,14,17
BTN_N: R60.1 S2.3 S2.4 U$41.1 ; also sheet 1
GND: R62.1 R63.1 S1.1 S1.2 S2.1 S2.2 U$40.2 U$41.2 U$42.2 U$43.2 U$44.2 ; also sheet 1,2,3,4,5,6,7,9,10,11,12,13,14,15,17,18,19,20
PMIC_PWRBTN_N: S1.3 S1.4 U$42.1 ; also sheet 1,3
SPI_1_FS2: U$16.P$3 U$44.1 ; also sheet 1,13
SPI_1_FS2_PD: R62.2 U$16.P$4
UART_1_TXD: U$16.P$1 U$43.1 ; also sheet 1,13
UART_1_TXD_PD: R63.2 U$16.P$2
UART_2_TXD: S3.1 S3.2 U$40.1 ; also sheet 1,9
UART_2_TXD_PU: R61.1 S3.3 S3.4

## Sheet 17 of 20: Misc. Breakout Board
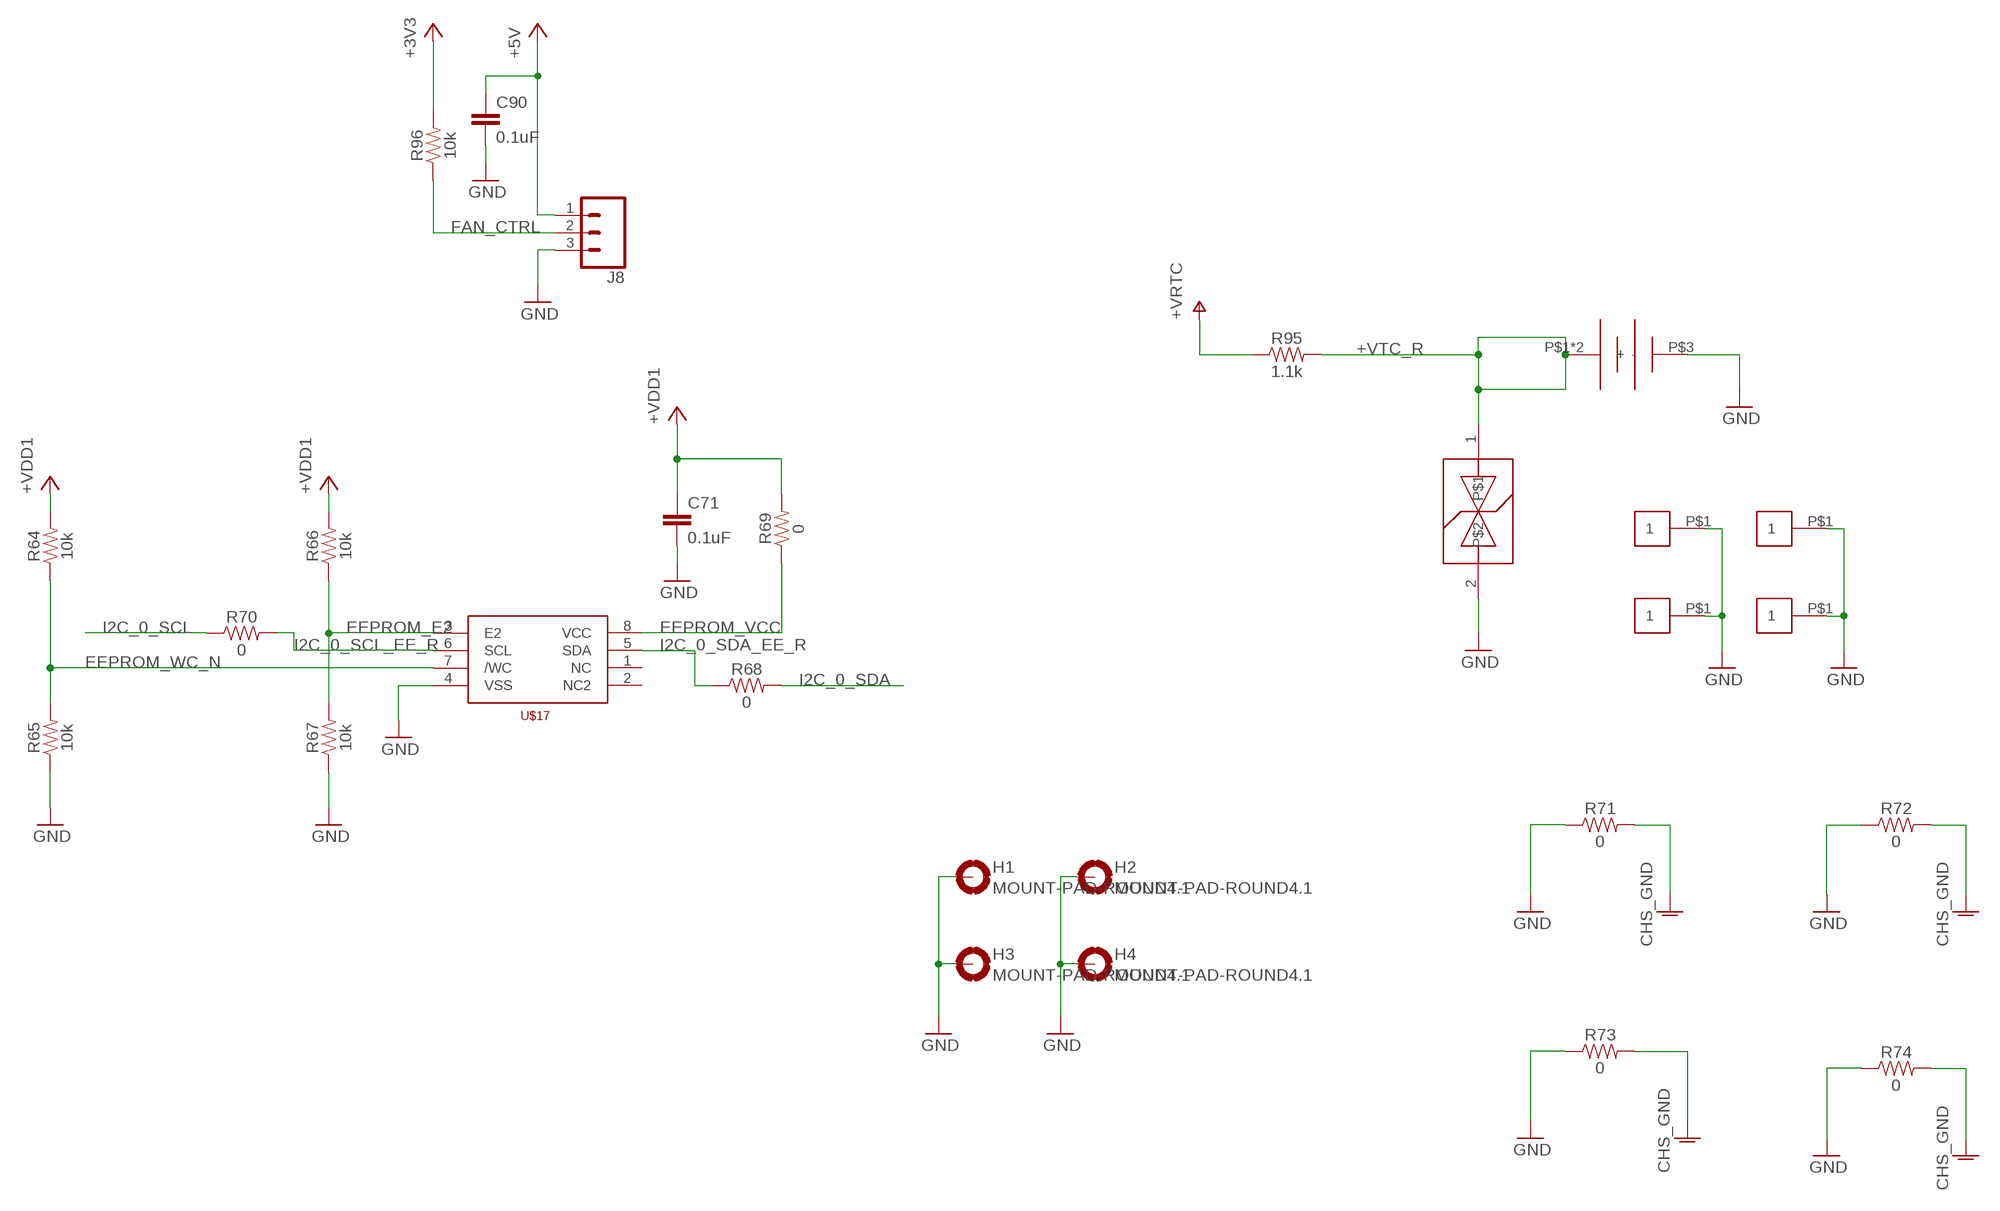
[diagram p16: schematic, sheet 17]

### Parts
C71  0.1uF  0.1UF-0603-25V-(+80/-20%)  [0603]
C90  0.1uF  0.1UF-0603-25V-(+80/-20%)  [0603]
H1  MOUNT-PAD-ROUND4.1  [4,1-PAD]
H2  MOUNT-PAD-ROUND4.1  [4,1-PAD]
H3  MOUNT-PAD-ROUND4.1  [4,1-PAD]
H4  MOUNT-PAD-ROUND4.1  [4,1-PAD]
J8  CONN_03SMD  [1X03-1MM-RA]
R64  10k  10KOHM-0603-1/10W-1%  [0603]
R65  10k  10KOHM-0603-1/10W-1%  [0603]
R66  10k  10KOHM-0603-1/10W-1%  [0603]
R67  10k  10KOHM-0603-1/10W-1%  [0603]
R68  0  0OHM-0603-1/10W-5%  [0603]
R69  0  0OHM-0603-1/10W-5%  [0603]
R70  0  0OHM-0603-1/10W-5%  [0603]
R71  0  0OHM-0603-1/10W-5%  [0603]
R72  0  0OHM-0603-1/10W-5%  [0603]
R73  0  0OHM-0603-1/10W-5%  [0603]
R74  0  0OHM-0603-1/10W-5%  [0603]
R95  1.1k  1KOHM-0603-1/10W-1%  [0603]
R96  10k  10KOHM-0603-1/10W-1%  [0603]
U$17  M24M02-DRMN6TP  [SOIC8]
U$29  LXES15AAA1-100_ESD_SUPPRESSOR  [0402]
U$30  BK-916-TR_12MM_COINCELL  [12MM_COINCELL]
U$45  92320A282_1/8_SPACER  [1/8"RING]
U$46  92320A282_1/8_SPACER  [1/8"RING]
U$47  92320A282_1/8_SPACER  [1/8"RING]
U$48  92320A282_1/8_SPACER  [1/8"RING]

### Nets
+3V3: R96.2 ; also sheet 5,7,9,10,11,13,15,18,19,20
+5V: C90.1 J8.1 ; also sheet 4,9,12,14,15,18,19
+VDD1: C71.1 R64.2 R66.2 R69.2 ; also sheet 1,6,14,16
+VRTC: R95.1 ; also sheet 1
+VTC_R: R95.2 U$29.1 U$30.P$1(+) U$30.P$2(+)
CHS_GND: R71.2 R72.2 R73.2 R74.2 ; also sheet 2,7,8,9,10,12
EEPROM_E2: R66.1 R67.2 U$17.3(E2)
EEPROM_VCC: R69.1 U$17.8(VCC)
EEPROM_WC_N: R64.1 R65.2 U$17.7(/WC)
FAN_CTRL: J8.2 R96.1
GND: C71.2 C90.2 H1.B4,1(MOUNT) H2.B4,1(MOUNT) H3.B4,1(MOUNT) H4.B4,1(MOUNT) J8.3 R65.1 R67.1 R71.1 R72.1 R73.1 R74.1 U$17.4(VSS) U$29.2 U$30.P$3(-) U$45.P$1 U$46.P$1 U$47.P$1 U$48.P$1 ; also sheet 1,2,3,4,5,6,7,9,10,11,12,13,14,15,16,18,19,20
I2C_0_SCL: R70.1 ; also sheet 1,3,13
I2C_0_SCL_EE_R: R70.2 U$17.6(SCL)
I2C_0_SDA: R68.2 ; also sheet 1,3,13
I2C_0_SDA_EE_R: R68.1 U$17.5(SDA)
Unconnected: U$17.1(NC) U$17.2(NC2)

## Sheet 18 of 20
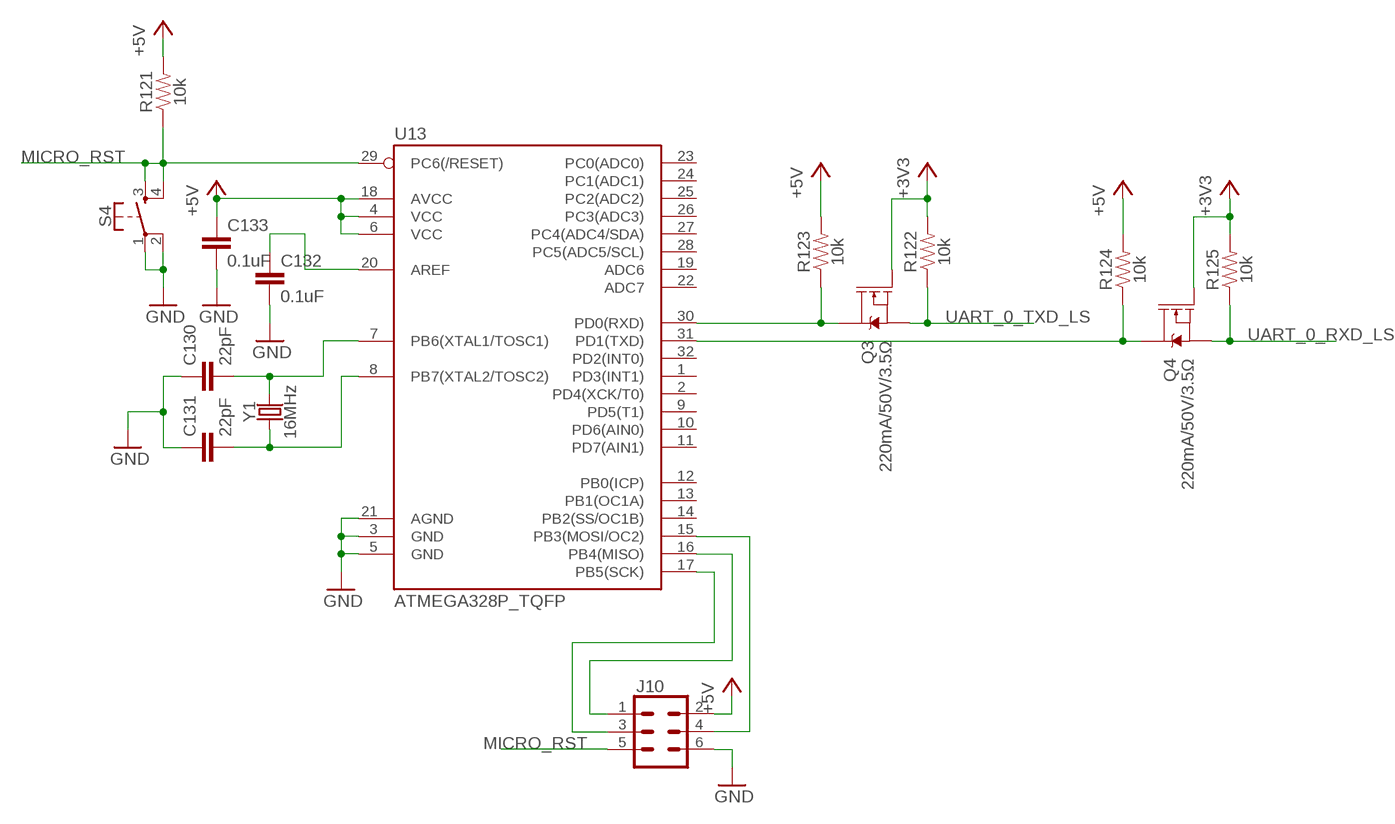
[diagram p17: schematic, sheet 18]

### Parts
C130  22pF  22PF-0603-50V-5%  [0603]
C131  22pF  22PF-0603-50V-5%  [0603]
C132  0.1uF  0.1UF-0603-25V-(+80/-20%)  [0603]
C133  0.1uF  0.1UF-0603-25V-(+80/-20%)  [0603]
J10  CONN_03X2FEMALE_SMD  [2X3_SMD]
Q3  220mA/50V/3.5Ω  MOSFET-NCH-BSS138  [SOT23-3]
Q4  220mA/50V/3.5Ω  MOSFET-NCH-BSS138  [SOT23-3]
R121  10k  10KOHM-0603-1/10W-1%  [0603]
R122  10k  10KOHM-0603-1/10W-1%  [0603]
R123  10k  10KOHM-0603-1/10W-1%  [0603]
R124  10k  10KOHM-0603-1/10W-1%  [0603]
R125  10k  10KOHM-0603-1/10W-1%  [0603]
S4  MOMENTARY-SWITCH-SPST-2-SMD-4.6X2.8MM  [TACTILE_SWITCH_SMD_4.6X2.8MM]
U13  ATMEGA328P_TQFP  [TQFP32-08]
Y1  16MHz  CRYSTAL-16MHZSMD-5X3.2  [CRYSTAL-SMD-5X3.2-4PAD]

### Nets
+3V3: Q3.1(G) Q4.1(G) R122.2 R125.2 ; also sheet 5,7,9,10,11,13,15,17,19,20
+5V: C133.1 J10.2 R121.2 R123.2 R124.2 U13.4(VCC) U13.6(VCC) U13.18(AVCC) ; also sheet 4,9,12,14,15,17,19
GND: C130.1 C131.1 C132.2 C133.2 J10.6 S4.1 S4.2 U13.3(GND) U13.5(GND) U13.21(AGND) ; also sheet 1,2,3,4,5,6,7,9,10,11,12,13,14,15,16,17,19,20
MICRO_RST: J10.5 R121.1 S4.3 S4.4 U13.29(PC6(/RESET))
N$2: J10.4 U13.15(PB3(MOSI/OC2))
N$3: J10.1 U13.16(PB4(MISO))
N$6: J10.3 U13.17(PB5(SCK))
N$7: C130.2 U13.7(PB6(XTAL1/TOSC1)) Y1.3
N$9: C131.2 U13.8(PB7(XTAL2/TOSC2)) Y1.1
N$10: Q3.3(D) R123.1 U13.30(PD0(RXD))
N$15: C132.1 U13.20(AREF)
N$21: Q4.3(D) R124.1 U13.31(PD1(TXD))
UART_0_RXD_LS: Q4.2(S) R125.1 ; also sheet 15
UART_0_TXD_LS: Q3.2(S) R122.1 ; also sheet 13,14
Unconnected: U13.1(PD3(INT1)) U13.2(PD4(XCK/T0)) U13.9(PD5(T1)) U13.10(PD6(AIN0)) U13.11(PD7(AIN1)) U13.12(PB0(ICP)) U13.13(PB1(OC1A)) U13.14(PB2(SS/OC1B)) U13.19(ADC6) U13.22(ADC7) U13.23(PC0(ADC0)) U13.24(PC1(ADC1)) U13.25(PC2(ADC2)) U13.26(PC3(ADC3)) U13.27(PC4(ADC4/SDA)) U13.28(PC5(ADC5/SCL)) U13.32(PD2(INT0))